# Altium project KoneXH743v1.PrjPcb
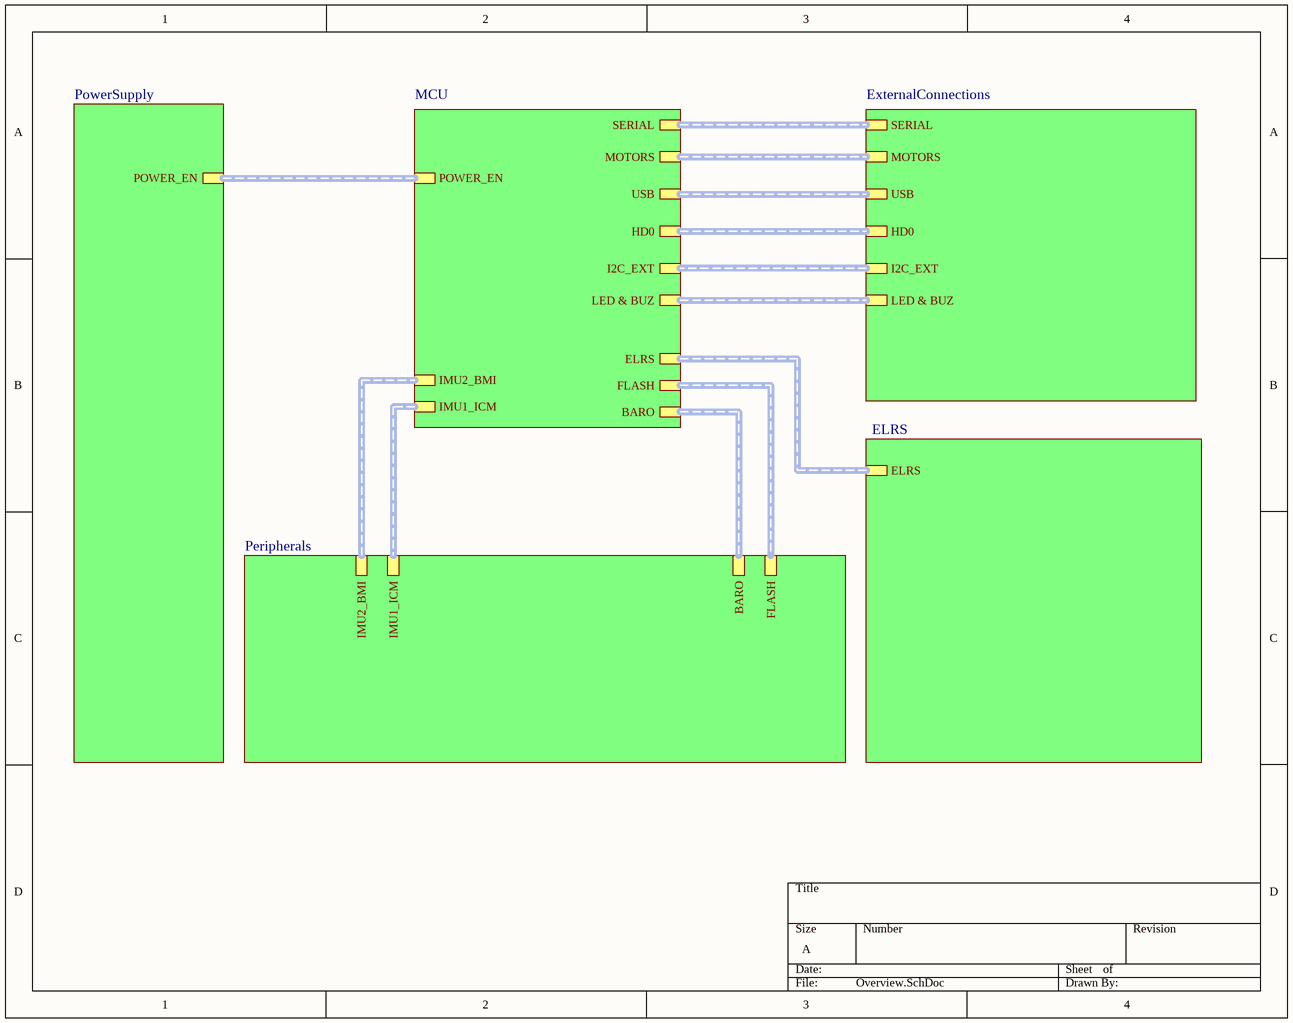
[diagram p0: Overview.SchDoc]
6 sheets, 172 parts. Net scope: hierarchical (ports join the sheet entries above them; power ports are global).
Board file: PCB_KoneXH743v1.PcbDoc
Sheets:
  Overview.SchDoc
    M1 = MCU.SchDoc
    P1 = Peripherals.SchDoc
    Pw = PowerSupply.SchDoc
    Ex = ExternalConnections.SchDoc
    RC = ELRS.SchDoc

## Sheet Overview.SchDoc
size A; SheetNumber: 1; SheetTotal: 6

### Sub-sheets
Ex = ExternalConnections: MOTORS, USB, HD0, I2C_EXT, LED & BUZ, SERIAL
M1 = MCU: IMU2_BMI, IMU1_ICM, BARO, FLASH, MOTORS, ELRS, USB, HD0, I2C_EXT, LED & BUZ, SERIAL, POWER_EN
P1 = Peripherals: IMU2_BMI, IMU1_ICM, BARO, FLASH
Pw = PowerSupply: POWER_EN
RC = ELRS: ELRS

### Buses and harness runs
harness sheet Ex/HD0 = sheet M1/HD0
harness sheet Ex/I2C_EXT = sheet M1/I2C_EXT
harness sheet Ex/LED & BUZ = sheet M1/LED & BUZ
harness sheet Ex/MOTORS = sheet M1/MOTORS
harness sheet Ex/SERIAL = sheet M1/SERIAL
harness sheet Ex/USB = sheet M1/USB
harness sheet M1/BARO = sheet P1/BARO
harness sheet M1/ELRS = sheet RC/ELRS
harness sheet M1/FLASH = sheet P1/FLASH
harness sheet M1/IMU1_ICM = sheet P1/IMU1_ICM
harness sheet M1/IMU2_BMI = sheet P1/IMU2_BMI
harness sheet M1/POWER_EN = sheet Pw/POWER_EN

## Sheet MCU.SchDoc
size A3; SheetNumber: 2; SheetTotal: 6
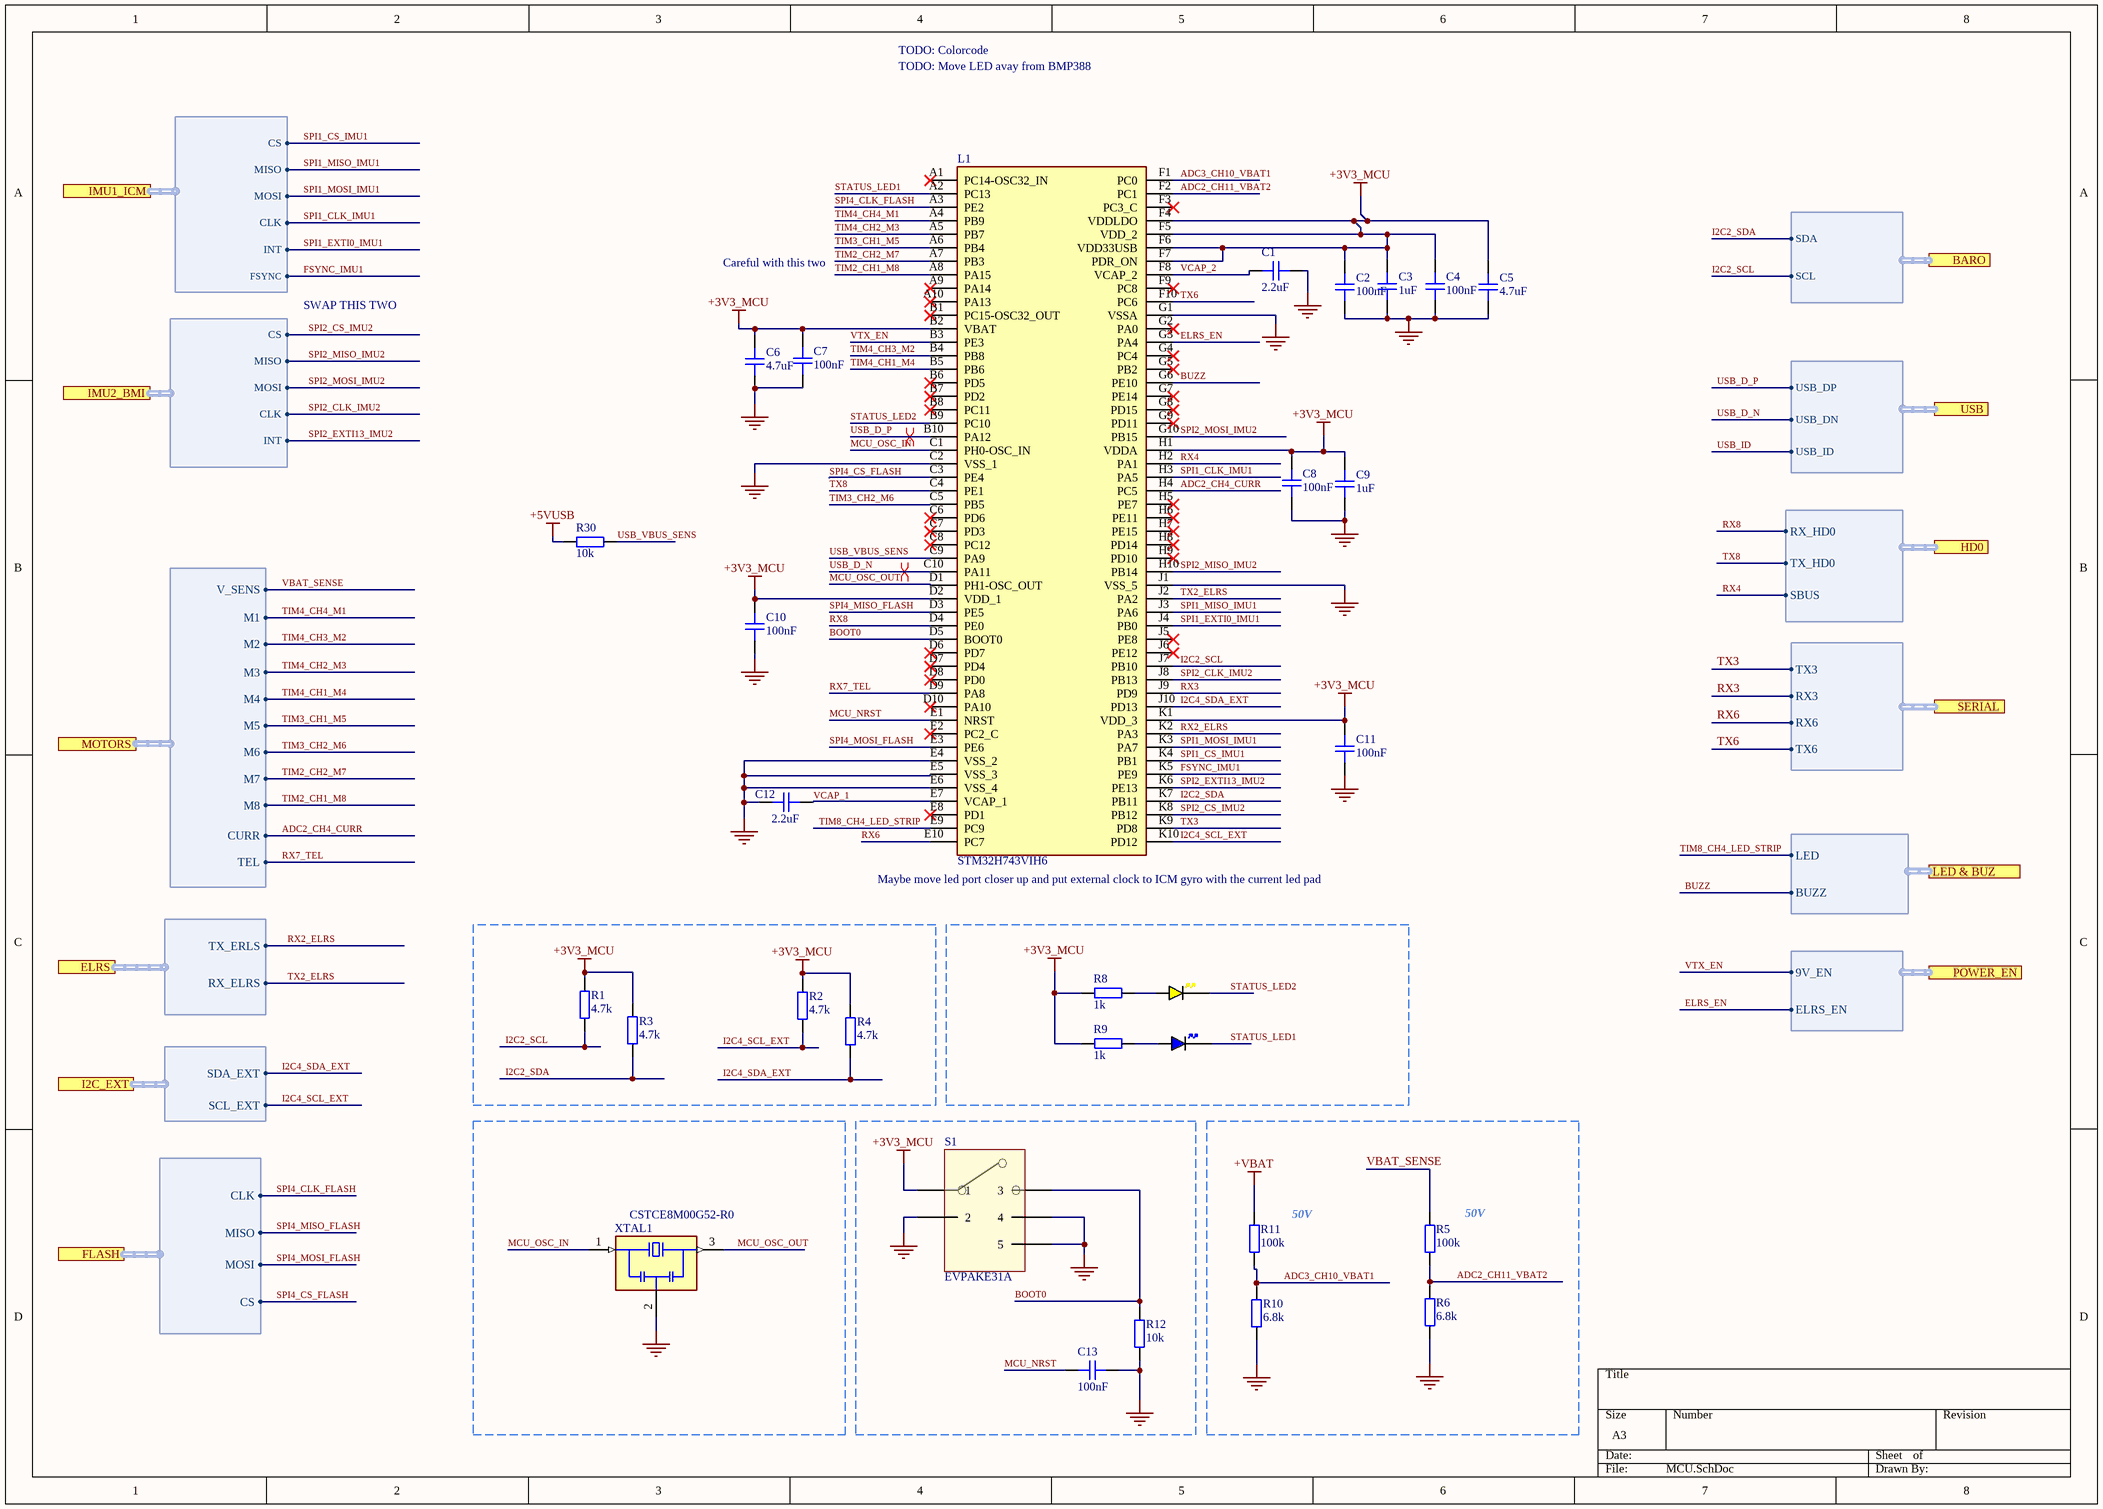
[diagram p1: MCU.SchDoc]

### Parts
C1  2.2uF  [CAP_0402]
C2  100nF  [CAP_0201]
C3  1uF  [CAP_0402]
C4  100nF  [CAP_0201]
C5  4.7uF  [CAP_0402]
C6  4.7uF  [CAP_0402]
C7  100nF  [CAP_0201]
C8  100nF  [CAP_0201]
C9  1uF  [CAP_0402]
C10  100nF  [CAP_0201]
C11  100nF  [CAP_0201]
C12  2.2uF  [CAP_0402]
C13  100nF  [CAP_0201]
L1  STM32H743VIH6  [BGA100C80P10X10_800X800X110]
LED1  YELLOW  [LED_0402_YELLOW]  (value not drawn)
LED2  BLUE  [LED_0402_BLUE]  (value not drawn)
R1  4.7k  [RES_0201]
R2  4.7k  [RES_0201]
R3  4.7k  [RES_0201]
R4  4.7k  [RES_0201]
R5  100k  [RES_0402]
R6  6.8k  [RES_0201]
R8  1k  [RES_0201]
R9  1k  [RES_0201]
R10  6.8k  [RES_0201]
R11  100k  [RES_0402]
R12  10k  [RES_0201]
R30  10k  [RES_0201]
S1  EVPAKE31A  [EVPAKE31A]
XTAL1  CSTCE8M00G52-R0  [OSC_CSTCE8M00G52-R0]

### Ports
BARO (harness I2C3_BARO, see Overview[3B], Peripherals[3A]), ELRS (harness ELRS, see Overview[3B], ELRS[2B]), FLASH (harness FLASH, see Overview[3B], Peripherals[3C]), HD0 (harness HD0, see Overview[3A], ExternalConnections[3C]), I2C_EXT (harness I2C_EXT, see Overview[3B], ExternalConnections[5C]), IMU1_ICM (harness IMU1, see Overview[2B], Peripherals[1A]), IMU2_BMI (harness IMU, see Overview[2B], Peripherals[1C]), LED & BUZ (harness MISC, see Overview[3B], ExternalConnections[5A]), MOTORS (harness MOTORS, see Overview[3A], ExternalConnections[1A]), POWER_EN (harness VTX_EN, see Overview[2A], PowerSupply[1B]), SERIAL (harness SERIAL, see Overview[3A], ExternalConnections[2C]), USB (harness USB, see Overview[3A], ExternalConnections[1C])

### Harnesses
SERIAL: TX3, RX3, RX6, TX6
I2C3_BARO: SDA, SCL
USB: USB_DP, USB_DN, USB_ID
IMU: CS, MISO, MOSI, CLK, INT
MOTORS: M2, M3, M4, M5, M6, M1, M7, M8, CURR, TEL, V_SENS
MISC: BUZZ, LED
I2C_EXT: SDA_EXT, SCL_EXT
IMU1: CS, MISO, MOSI, CLK, INT, FSYNC
ELRS: TX_ERLS, RX_ELRS
FLASH: CLK, MISO, MOSI, CS
HD0: RX_HD0, TX_HD0, SBUS
VTX_EN: 9V_EN, ELRS_EN

### Nets
+3V3_MCU: C2.2 C3.2 C4.2 C5.2 C6.2 C7.2 C8.2 C9.2 C10.2 C11.2 L1.B2(VBAT) L1.D2(VDD_1) L1.F4(VDDLDO) L1.F5(VDD_2) L1.F6(VDD33USB) L1.F7(PDR_ON) L1.H1(VDDA) L1.K1(VDD_3) R1.2 R2.2 R3.2 R4.2 R8.1 R9.1 S1.1
+5VUSB: R30.1
+VBAT: R11.2
GND: C1.2 C2.1 C3.1 C4.1 C5.1 C6.1 C7.1 C8.1 C9.1 C10.1 C11.1 C12.1 C13.2 L1.C2(VSS_1) L1.E4(VSS_2) L1.E5(VSS_3) L1.E6(VSS_4) L1.G1(VSSA) L1.J1(VSS_5) R6.1 R10.1 R12.1 S1.2 S1.4 S1.5 XTAL1.2(GND)
ADC2_CH4_CURR: L1.H4(PC5) ; port MOTORS.CURR
ADC2_CH11_VBAT2: L1.F2(PC1) R5.1 R6.2
ADC3_CH10_VBAT1: L1.F1(PC0) R10.2 R11.1
BOOT0: L1.D5(BOOT0) R12.2 S1.3
BUZZ: L1.G6(PE10) ; port LED & BUZ.BUZZ
ELRS_EN: L1.G3(PA4) ; port POWER_EN.ELRS_EN
FSYNC_IMU1: L1.K5(PE9) ; port IMU1_ICM.FSYNC
I2C2_SCL: L1.J7(PB10) R1.1 ; port BARO.SCL
I2C2_SDA: L1.K7(PB11) R3.1 ; port BARO.SDA
I2C4_SCL_EXT: L1.K10(PD12) R2.1 ; port I2C_EXT.SCL_EXT
I2C4_SDA_EXT: L1.J10(PD13) R4.1 ; port I2C_EXT.SDA_EXT
MCU_NRST: C13.1 L1.E1(NRST)
MCU_OSC_IN: L1.C1(PH0-OSC_IN) XTAL1.1(IN)
MCU_OSC_OUT: L1.D1(PH1-OSC_OUT) XTAL1.3(OUT)
RX2_ELRS: L1.K2(PA3) ; port ELRS.TX_ERLS  [project net ELRS_TX]
RX3: L1.J9(PD9) ; port SERIAL.RX3
RX4: L1.H2(PA1) ; port HD0.SBUS
RX6: L1.E10(PC7) ; port SERIAL.RX6
RX7_TEL: L1.D9(PA8) ; port MOTORS.TEL
RX8: L1.D4(PE0) ; port HD0.RX_HD0
SPI1_CLK_IMU1: L1.H3(PA5) ; port IMU1_ICM.CLK
SPI1_CS_IMU1: L1.K4(PB1) ; port IMU1_ICM.CS
SPI1_EXTI0_IMU1: L1.J4(PB0) ; port IMU1_ICM.INT
SPI1_MISO_IMU1: L1.J3(PA6) ; port IMU1_ICM.MISO
SPI1_MOSI_IMU1: L1.K3(PA7) ; port IMU1_ICM.MOSI
SPI2_CLK_IMU2: L1.J8(PB13) ; port IMU2_BMI.CLK
SPI2_CS_IMU2: L1.K8(PB12) ; port IMU2_BMI.CS
SPI2_EXTI13_IMU2: L1.K6(PE13) ; port IMU2_BMI.INT
SPI2_MISO_IMU2: L1.H10(PB14) ; port IMU2_BMI.MISO
SPI2_MOSI_IMU2: L1.G10(PB15) ; port IMU2_BMI.MOSI
SPI4_CLK_FLASH: L1.A3(PE2) ; port FLASH.CLK  [project net CLK_FLASH]
SPI4_CS_FLASH: L1.C3(PE4) ; port FLASH.CS  [project net CS_FLASH]
SPI4_MISO_FLASH: L1.D3(PE5) ; port FLASH.MISO  [project net MISO_FLASH]
SPI4_MOSI_FLASH: L1.E3(PE6) ; port FLASH.MOSI  [project net MOSI_FLASH]
STATUS_LED1: L1.A2(PC13) LED2.K
STATUS_LED2: L1.B9(PC10) LED1.K
TIM2_CH1_M8: L1.A8(PA15) ; port MOTORS.M8  [project net M8]
TIM2_CH2_M7: L1.A7(PB3) ; port MOTORS.M7  [project net M7]
TIM3_CH1_M5: L1.A6(PB4) ; port MOTORS.M5  [project net M5]
TIM3_CH2_M6: L1.C5(PB5) ; port MOTORS.M6  [project net M6]
TIM4_CH1_M4: L1.B5(PB6) ; port MOTORS.M4  [project net M4]
TIM4_CH2_M3: L1.A5(PB7) ; port MOTORS.M3  [project net M3]
TIM4_CH3_M2: L1.B4(PB8) ; port MOTORS.M2  [project net M2]
TIM4_CH4_M1: L1.A4(PB9) ; port MOTORS.M1  [project net M1]
TIM8_CH4_LED_STRIP: L1.E9(PC9) ; port LED & BUZ.LED  [project net LED_STRIP]
TX2_ELRS: L1.J2(PA2) ; port ELRS.RX_ELRS  [project net ELRS_RX]
TX3: L1.K9(PD8) ; port SERIAL.TX3
TX6: L1.F10(PC6) ; port SERIAL.TX6
TX8: L1.C4(PE1) ; port HD0.TX_HD0
USB_D_N: L1.C10(PA11) ; port USB.USB_DN
USB_D_P: L1.B10(PA12) ; port USB.USB_DP
USB_ID: port USB.USB_ID
USB_VBUS_SENS: L1.C9(PA9) R30.2
VBAT_SENSE: R5.2 ; port MOTORS.V_SENS  [project net VBAT_SENS]
VCAP_1: C12.2 L1.E7(VCAP_1)
VCAP_2: C1.1 L1.F8(VCAP_2)
VTX_EN: L1.B3(PE3) ; port POWER_EN.9V_EN  [project net 9V_EN]
NetLED1_A: LED1.A R8.2
NetLED2_A: LED2.A R9.2

Not connected (* = marked no-connect by the designer): L1 A1(PC14-OSC32_IN)* A9(PA14)* A10(PA13)* B1(PC15-OSC32_OUT)* B6(PD5)* B7(PD2)* B8(PC11)* C6(PD6)* C7(PD3)* C8(PC12)* D6(PD7)* D7(PD4)* D8(PD0)* D10(PA10)* E2(PC2_C)* E8(PD1)* F3(PC3_C)* F9(PC8)* G2(PA0)* G4(PC4)* G5(PB2)* G7(PE14)* G8(PD15)* G9(PD11)* H5(PE7)* H6(PE11)* H7(PE15)* H8(PD14)* H9(PD10)* J5(PE8)* J6(PE12)*

### Layout directives
differential pair: USB_D_N, USB_D_P

### Notes on the sheet
- TODO: Colorcode
- TODO: Move LED avay from BMP388
- SWAP THIS TWO
- Careful with this two
- (near L1) Maybe move led port closer up and put external clock to ICM gyro with the current led pad
- (near R11) 50V
- (near R5) 50V

### Library data of the parts
C1 C3 C5 C6 C9 C12 = CAP_0402: Capacitor SMD 0402; Manufacturer: *; Manufacturer Part Number: *; Distributor Link: *; LCSC: *; Rating: *; Dielectric: *
C2 C4 C7 C8 C10 C11 C13 = CAP_0201: Capacitor SMD 0201; Manufacturer: *; Manufacturer Part Number: *; Distributor Link: *; LCSC: *; Rating: *; Dielectric: *
L1 = STM32H743VIH6: Inductor; Manufacturer_Name: STMicroelectronics; Datasheet Link: https://www.st.com/resource/en/datasheet/stm32h743vi.pdf; Height: 1.1mm; Manufacturer_Part_Number: STM32H743VIH6; Mouser Part Number: 511-STM32H743VIH6; Mouser Price/Stock: https://www.mouser.co.uk/ProductDetail/STMicroelectronics/STM32H743VIH6?qs=EU6FO9ffTwep%252BmI4YnA3%2Fw%3D%3D; Arrow Part Number: STM32H743VIH6; Arrow Price/Stock: https://www.arrow.com/en/products/stm32h743vih6/stmicroelectronics?region=nac
LED1 = LED_0402_YELLOW: LED 0402 YELLOW SMD
LED2 = LED_0402_BLUE: LED 0402 BLUE SMD
R1-R4 R6 R8-R10 R12 R30 = RES_0201: Resistor SMD 0201; Manufacturer: *; Manufacturer Part Number: *; Distributor Link: *; LCSC: *
R5 R11 = RES_0402: Resistor SMD 0402; Manufacturer: *; Manufacturer Part Number: *; Distributor Link: *; LCSC: *
XTAL1 = CSTCE8M00G52-R0: 8MHz Ceramic Resonator Built in Capacitor 10pF Â±0.2% -20Â°C ~ 80Â°C Surface Mount; MF: Murata; Price: None; Check_prices: https://www.snapeda.com/parts/CSTCE8M00G52-R0/Murata%20Electronics%20North%20America/view-part/234504/?ref=eda; SnapEDA_Link: https://www.snapeda.com/parts/CSTCE8M00G52-R0/Murata%20Electronics%20North%20America/view-part/234504/?ref=snap; Package: Surface Mount Murata Electronics North America; Availability: Bad; MP: CSTCE8M00G52-R0; Value: *

## Sheet Peripherals.SchDoc
size B; SheetNumber: 4; SheetTotal: 6
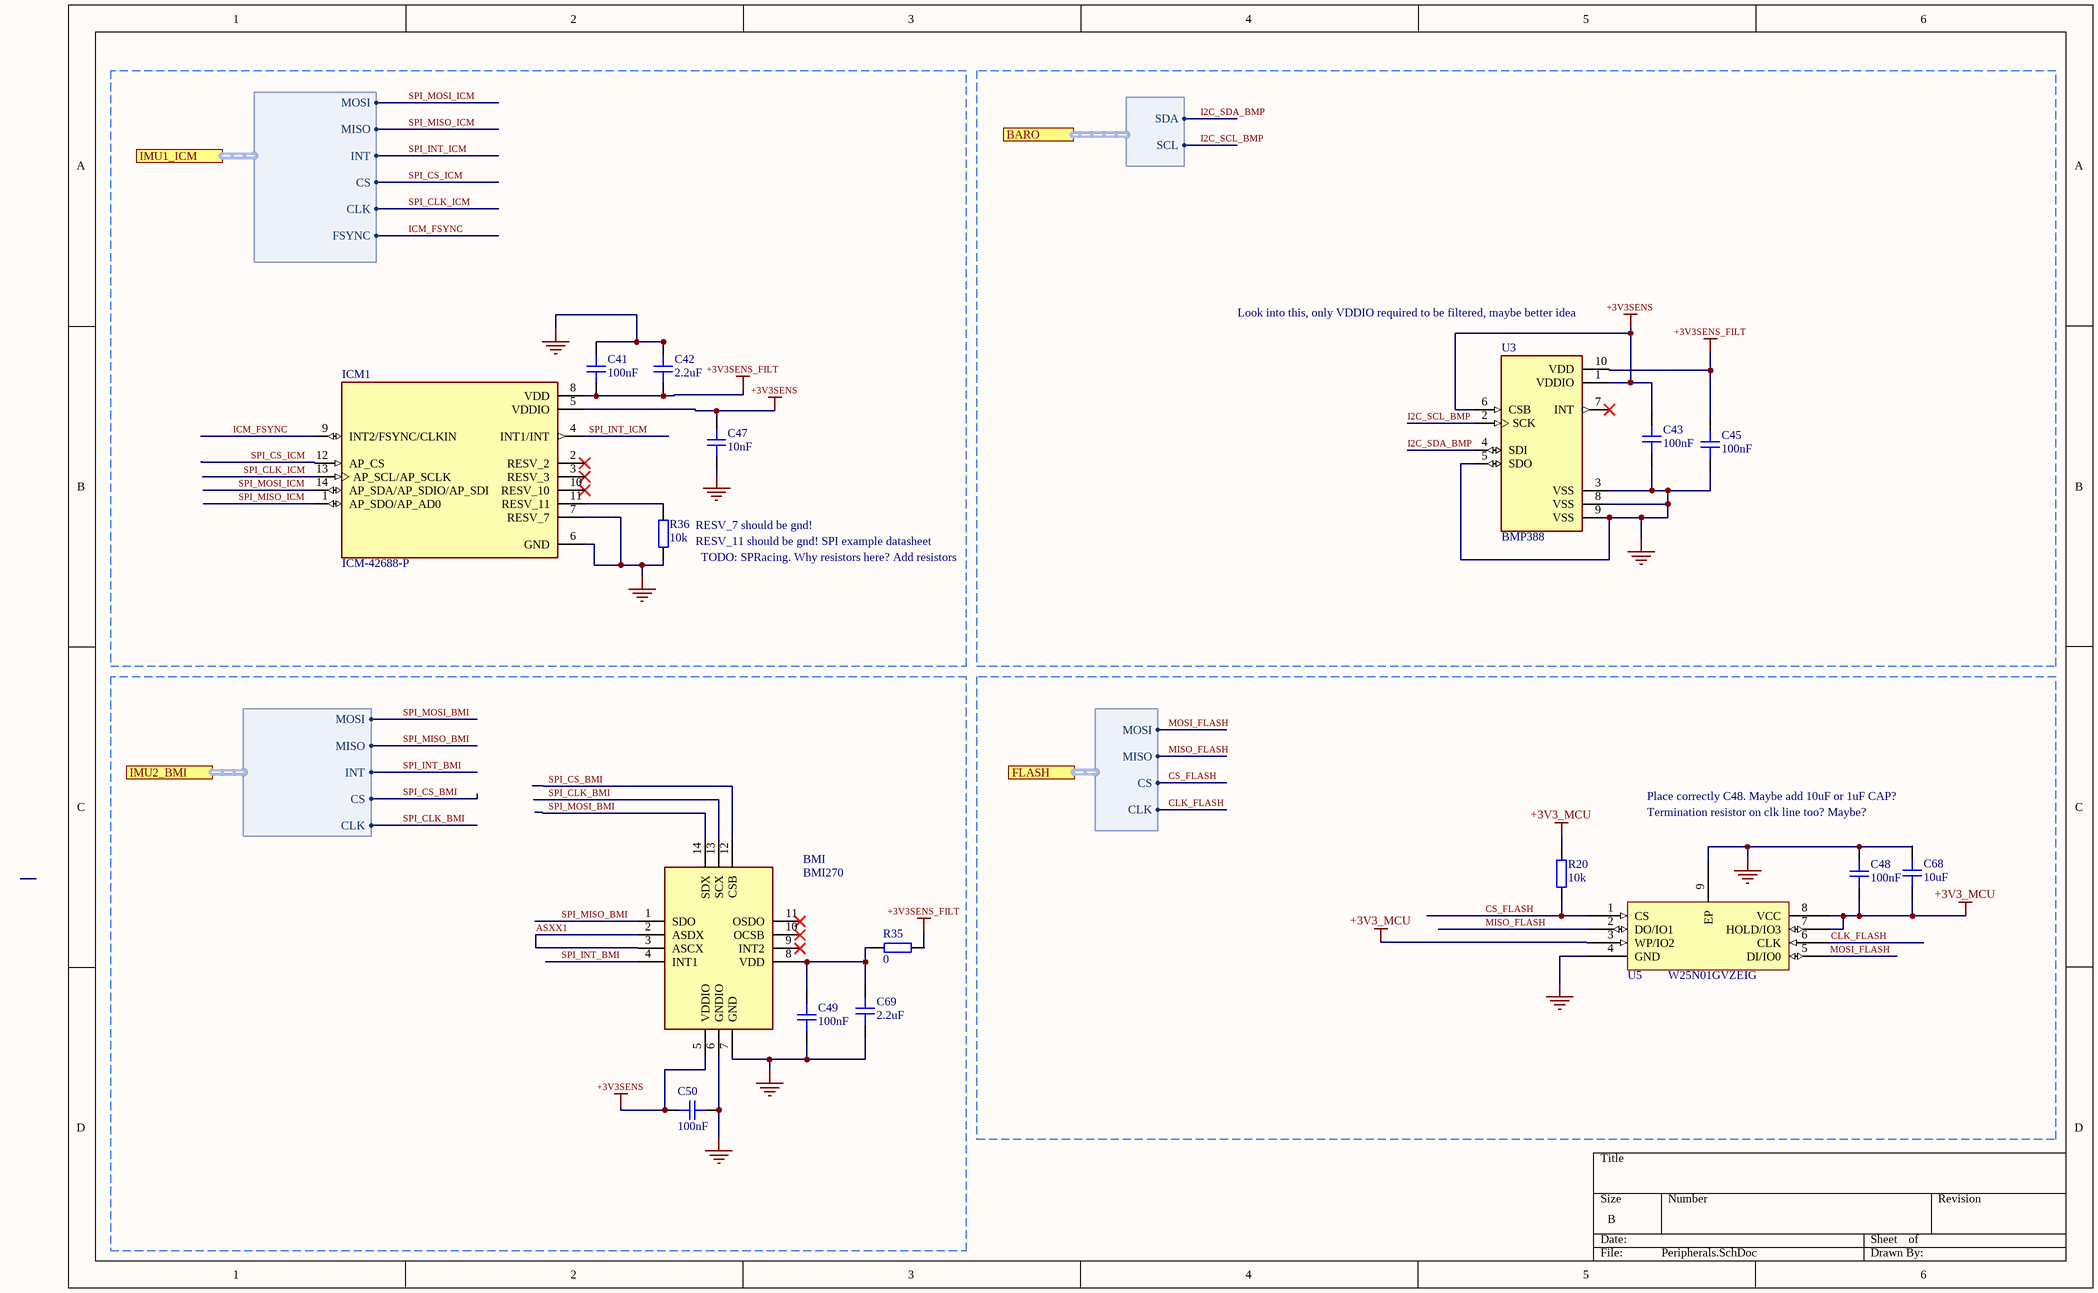
[diagram p2: Peripherals.SchDoc]

### Parts
BMI  BMI270  [BMI270]
C41  100nF  [CAP_0201]
C42  2.2uF  [CAP_0402]
C43  100nF  [CAP_0201]
C45  100nF  [CAP_0201]
C47  10nF  [CAP_0201]
C48  100nF  [CAP_0201]
C49  100nF  [CAP_0201]
C50  100nF  [CAP_0201]
C68  10uF  [CAP_0402]
C69  2.2uF  [CAP_0402]
ICM1  ICM-42688-P  [ICM-42688-P]
R20  10k  [RES_0201]
R35  0  [RES_0402]
R36  10k  [RES_0201]
U3  BMP388  [PQFN50P200X200X80-10N]
U5  W25N01GVZEIG  [W25N01GVZEIG]

### Ports
BARO (harness I2C3_BARO, see Overview[3C], MCU[8A]), FLASH (harness FLASH, see Overview[3C], MCU[1D]), IMU1_ICM (harness IMU1, see Overview[2C], MCU[1A]), IMU2_BMI (harness IMU, see Overview[2C], MCU[1B])

### Harnesses
IMU: CLK, CS, INT, MISO, MOSI
IMU1: CLK, CS, INT, MISO, MOSI, FSYNC
I2C3_BARO: SCL, SDA
FLASH: CLK, CS, MISO, MOSI

### Nets
+3V3_MCU: C48.1 C68.1 R20.2 U5.3(WP/IO2) U5.7(HOLD/IO3) U5.8(VCC)
+3V3SENS: BMI.5(VDDIO) C43.2 C47.2 C50.2 ICM1.5(VDDIO) U3.1(VDDIO) U3.6(CSB)
+3V3SENS_FILT: C41.1 C42.1 C45.2 ICM1.8(VDD) R35.2 U3.10(VDD)
GND: BMI.6(GNDIO) BMI.7(GND) C41.2 C42.2 C43.1 C45.1 C47.1 C48.2 C49.1 C50.1 C68.2 C69.1 ICM1.6(GND) ICM1.7(RESV_7) R36.1 U3.3(VSS) U3.5(SDO) U3.8(VSS) U3.9(VSS) U5.4(GND) U5.9(EP)
ASXX1: BMI.2(ASDX) BMI.3(ASCX)
CLK_FLASH: U5.6(CLK) ; port FLASH.CLK
CS_FLASH: R20.1 U5.1(CS) ; port FLASH.CS
I2C_SCL_BMP: U3.2(SCK) ; port BARO.SCL  [project net I2C2_SCL]
I2C_SDA_BMP: U3.4(SDI) ; port BARO.SDA  [project net I2C2_SDA]
ICM_FSYNC: ICM1.9(INT2/FSYNC/CLKIN) ; port IMU1_ICM.FSYNC  [project net FSYNC_IMU1]
MISO_FLASH: U5.2(DO/IO1) ; port FLASH.MISO
MOSI_FLASH: U5.5(DI/IO0) ; port FLASH.MOSI
SPI_CLK_BMI: BMI.13(SCX) ; port IMU2_BMI.CLK  [project net SPI2_CLK_IMU2]
SPI_CLK_ICM: ICM1.13(AP_SCL/AP_SCLK) ; port IMU1_ICM.CLK  [project net SPI1_CLK_IMU1]
SPI_CS_BMI: BMI.12(CSB) ; port IMU2_BMI.CS  [project net SPI2_CS_IMU2]
SPI_CS_ICM: ICM1.12(AP_CS) ; port IMU1_ICM.CS  [project net SPI1_CS_IMU1]
SPI_INT_BMI: BMI.4(INT1) ; port IMU2_BMI.INT  [project net SPI2_EXTI13_IMU2]
SPI_INT_ICM: ICM1.4(INT1/INT) ; port IMU1_ICM.INT  [project net SPI1_EXTI0_IMU1]
SPI_MISO_BMI: BMI.1(SDO) ; port IMU2_BMI.MISO  [project net SPI2_MISO_IMU2]
SPI_MISO_ICM: ICM1.1(AP_SDO/AP_AD0) ; port IMU1_ICM.MISO  [project net SPI1_MISO_IMU1]
SPI_MOSI_BMI: BMI.14(SDX) ; port IMU2_BMI.MOSI  [project net SPI2_MOSI_IMU2]
SPI_MOSI_ICM: ICM1.14(AP_SDA/AP_SDIO/AP_SDI) ; port IMU1_ICM.MOSI  [project net SPI1_MOSI_IMU1]
NetBMI_8: BMI.8(VDD) C49.2 C69.2 R35.1
NetICM1_11: ICM1.11(RESV_11) R36.2

Not connected (* = marked no-connect by the designer): BMI 9(INT2)* 10(OCSB)* 11(OSDO)*; ICM1 2(RESV_2)* 3(RESV_3)* 10(RESV_10)*; U3 7(INT)*

### Notes on the sheet
- (near U3) Look into this, only VDDIO required to be filtered, maybe better idea
- (near R36) RESV_7 should be gnd!
- (near R36) RESV_11 should be gnd! SPI example datasheet
- (near R36) TODO: SPRacing. Why resistors here? Add resistors
- Termination resistor on clk line too? Maybe?
- Place correctly C48. Maybe add 10uF or 1uF CAP?

### Library data of the parts
BMI = BMI270: Integrated Circuit; Manufacturer_Name: BOSCH; Datasheet Link: https://www.mouser.de/datasheet/2/783/BST-BMI270-FL000-1530947.pdf; Height: 0.87mm; Manufacturer_Part_Number: BMI270; Mouser Part Number: 262-BMI270; Mouser Price/Stock: https://www.mouser.co.uk/ProductDetail/Bosch-Sensortec/BMI270?qs=u16ybLDytRYIj%252BjQEee88A%3D%3D; Arrow Part Number: BMI270; Arrow Price/Stock: https://www.arrow.com/en/products/bmi270/bosch?region=nac
C41 C43 C45 C47-C50 = CAP_0201: Capacitor SMD 0201; Manufacturer: *; Manufacturer Part Number: *; Distributor Link: *; LCSC: *; Rating: *; Dielectric: *
C42 C68 C69 = CAP_0402: Capacitor SMD 0402; Manufacturer: *; Manufacturer Part Number: *; Distributor Link: *; LCSC: *; Rating: *; Dielectric: *
R20 R36 = RES_0201: Resistor SMD 0201; Manufacturer: *; Manufacturer Part Number: *; Distributor Link: *; LCSC: *
R35 = RES_0402: Resistor SMD 0402; Manufacturer: *; Manufacturer Part Number: *; Distributor Link: *; LCSC: *
U3 = BMP388: P-Sensor SPI I2C 1, 25 Bar SMD; Package: None; Price: None; Value: *; MP: BMP388; Availability: Unavailable
U5 = W25N01GVZEIG: Manufacturer: Windbond Elec; Manufacturer part: W25N01GVZEIG; LCSC part: C88868

## Sheet PowerSupply.SchDoc
size A3; SheetNumber: 3; SheetTotal: 6
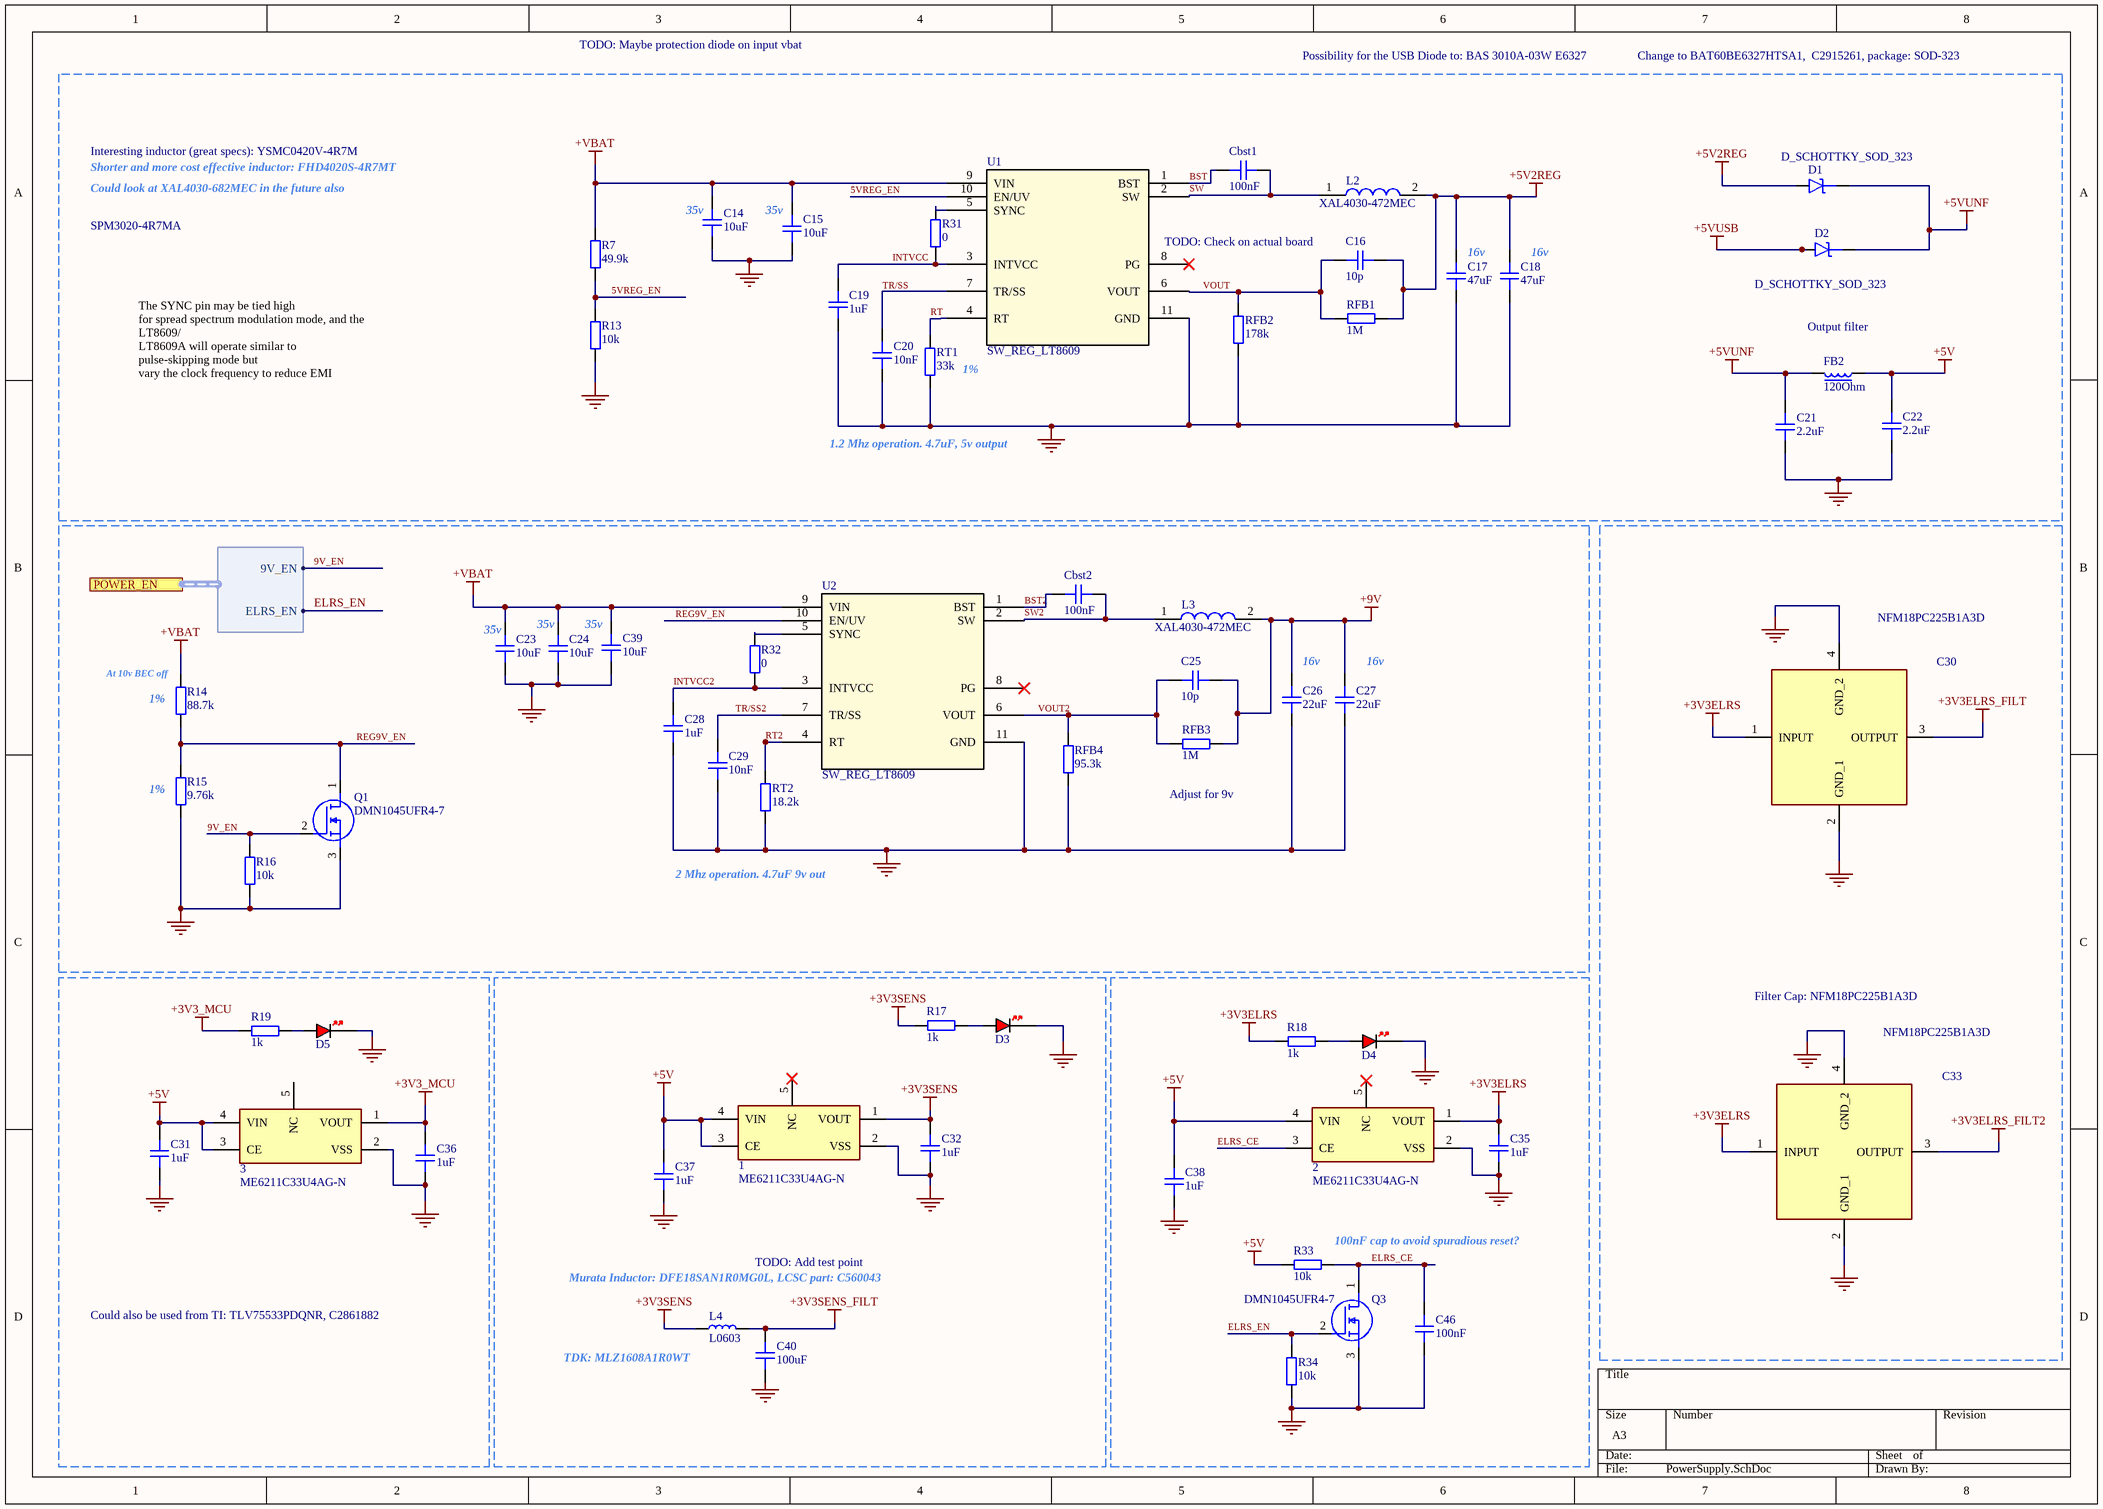
[diagram p3: PowerSupply.SchDoc]

### Parts
1  ME6211C33U4AG-N  [X2-SON-4-EP(1x1)]
2  ME6211C33U4AG-N  [X2-SON-4-EP(1x1)]
3  ME6211C33U4AG-N  [X2-SON-4-EP(1x1)]
C14  10uF  [CAP_0805]
C15  10uF  [CAP_0805]
C16  10p  [CAP_0201]
C17  47uF  [CAP_0603]
C18  47uF  [CAP_0603]
C19  1uF  [CAP_0402]
C20  10nF  [CAP_0201]
C21  2.2uF  [CAP_0402]
C22  2.2uF  [CAP_0402]
C23  10uF  [CAP_0805]
C24  10uF  [CAP_0805]
C25  10p  [CAP_0201]
C26  22uF  [CAP_0603]
C27  22uF  [CAP_0603]
C28  1uF  [CAP_0402]
C29  10nF  [CAP_0201]
C30  NFM18PC225B1A3D  [NFM18PC225B1A3D]
C31  1uF  [CAP_0402]
C32  1uF  [CAP_0402]
C33  NFM18PC225B1A3D  [NFM18PC225B1A3D]
C35  1uF  [CAP_0402]
C36  1uF  [CAP_0402]
C37  1uF  [CAP_0402]
C38  1uF  [CAP_0402]
C39  10uF  [CAP_0603]
C40  100uF  [CAP_0805]
C46  100nF  [CAP_0201]
Cbst1  100nF  [CAP_0201]
Cbst2  100nF  [CAP_0201]
D1  D_SCHOTTKY_SOD_323  [SOD-323]
D2  D_SCHOTTKY_SOD_323  [SOD-323]
D3  RED  [LED_0402_RED]  (value not drawn)
D4  RED  [LED_0402_RED]  (value not drawn)
D5  RED  [LED_0402_RED]  (value not drawn)
FB2  120Ohm  [FB_0603]
L2  XAL4030-472MEC  [IND-SMD_L4.0-W4.0]
L3  XAL4030-472MEC  [IND-SMD_L4.0-W4.0]
L4  L0603  [IND_0603]
Q1  DMN1045UFR4-7  [DMP1200UFR47]
Q3  DMN1045UFR4-7  [DMP1200UFR47]
R7  49.9k  [RES_0402]
R13  10k  [RES_0201]
R14  88.7k  [RES_0402]
R15  9.76k  [RES_0201]
R16  10k  [RES_0201]
R17  1k  [RES_0201]
R18  1k  [RES_0201]
R19  1k  [RES_0201]
R31  0  [RES_0201]
R32  0  [RES_0201]
R33  10k  [RES_0201]
R34  10k  [RES_0201]
RFB1  1M  [RES_0201]
RFB2  178k  [RES_0201]
RFB3  1M  [RES_0201]
RFB4  95.3k  [RES_0201]
RT1  33k  [RES_0201]
RT2  18.2k  [RES_0201]
U1  SW_REG_LT8609  [SW_REG_LT8609]
U2  SW_REG_LT8609  [SW_REG_LT8609]

### Blocks framed on the sheet
Filter Cap: NFM18PC225B1A3D: C30 C33
Could also be used from TI: TLV75533PDQNR, C2861882: 3 C31 C36 D5 R19
100nF cap to avoid spuradious reset?: 2 C35 C38 C46 D4 Q3 R18 R33 R34

### Ports
POWER_EN (harness VTX_EN, see Overview[1A], MCU[8C])

### Harnesses
VTX_EN: 9V_EN, ELRS_EN

### Nets
+3V3_MCU: 3.1(VOUT) C36.2 R19.1
+3V3ELRS: 2.1(VOUT) C30.1(INPUT) C33.1(INPUT) C35.2 R18.1
+3V3ELRS_FILT: C30.3(OUTPUT)
+3V3ELRS_FILT2: C33.3(OUTPUT)
+3V3SENS: 1.1(VOUT) C32.2 L4.1 R17.1
+3V3SENS_FILT: C40.2 L4.2
+5V: 1.3(CE) 1.4(VIN) 2.4(VIN) 3.3(CE) 3.4(VIN) C22.2 C31.2 C37.2 C38.2 FB2.1 R33.2
+5V2REG: C16.2 C17.1 C18.1 D1.A L2.2 RFB1.1
+5VUNF: C21.2 D1.K D2.K FB2.2
+5VUSB: D2.A
+9V: C25.2 C26.1 C27.1 L3.2 RFB3.1
+VBAT: C14.2 C15.2 C23.2 C24.2 C39.2 R7.2 R14.2 U1.9(VIN) U2.9(VIN)
GND: 1.2(VSS) 2.2(VSS) 3.2(VSS) C14.1 C15.1 C17.2 C18.2 C19.1 C20.1 C21.1 C22.1 C23.1 C24.1 C26.2 C27.2 C28.1 C29.1 C30.2(GND_1) C30.4(GND_2) C31.1 C32.1 C33.2(GND_1) C33.4(GND_2) C35.1 C36.1 C37.1 C38.1 C39.1 C40.1 C46.1 D3.K D4.K D5.K Q1.3(S) Q3.3(S) R13.1 R15.1 R16.1 R34.1 RFB2.1 RFB4.1 RT1.1 RT2.2 U1.11(GND) U2.11(GND)
5VREG_EN: R7.1 R13.2 U1.10(EN/UV)
9V_EN: Q1.2(G) R16.2 ; port POWER_EN.9V_EN
BST: Cbst1.1 U1.1(BST)
BST2: Cbst2.1 U2.1(BST)
ELRS_CE: 2.3(CE) C46.2 Q3.1(D) R33.1
ELRS_EN: Q3.2(G) R34.2 ; port POWER_EN.ELRS_EN
INTVCC: C19.2 R31.1 U1.3(INTVCC)
INTVCC2: C28.2 R32.1 U2.3(INTVCC)
REG9V_EN: Q1.1(D) R14.1 R15.2 U2.10(EN/UV)
RT: RT1.2 U1.4(RT)
RT2: RT2.1 U2.4(RT)
SW: Cbst1.2 L2.1 U1.2(SW)
SW2: Cbst2.2 L3.1 U2.2(SW)
TR/SS: C20.2 U1.7(TR/SS)
TR/SS2: C29.2 U2.7(TR/SS)
VOUT: C16.1 RFB1.2 RFB2.2 U1.6(VOUT)
VOUT2: C25.1 RFB3.2 RFB4.2 U2.6(VOUT)
NetD3_A: D3.A R17.2
NetD4_A: D4.A R18.2
NetD5_A: D5.A R19.2
NetR31_2: R31.2 U1.5(SYNC)
NetR32_2: R32.2 U2.5(SYNC)

Not connected (* = marked no-connect by the designer): 1 5(NC)*; 2 5(NC)*; 3 5(NC); U1 8(PG)*; U2 8(PG)*

### Notes on the sheet
- TODO: Maybe protection diode on input vbat
- Possibility for the USB Diode to: BAS 3010A-03W E6327
- Change to BAT60BE6327HTSA1,  C2915261, package: SOD-323
- Shorter and more cost effective inductor: FHD4020S-4R7MT
- Interesting inductor (great specs): YSMC0420V-4R7M
- Could look at XAL4030-682MEC in the future also
- SPM3020-4R7MA
- (near C14) 35v
- (near C15) 35v
- TODO: Check on actual board
- (near C17) 16v
- (near C18) 16v
- 1%
- (near FB2) Output filter
- The SYNC pin may be tied high
  for spread spectrum modulation mode, and the LT8609/
  LT8609A will operate similar to pulse-skipping mode but
  vary the clock frequency to reduce EMI
- 1.2 Mhz operation. 4.7uF, 5v output
- (near C23) 35v
- (near C24) 35v
- (near C39) 35v
- (near R14) At 10v BEC off
- (near R14) 1%
- 16v
- (near C27) 16v
- (near R15) 1%
- (near RFB3) Adjust for 9v
- 2 Mhz operation. 4.7uF 9v out
- Murata Inductor: DFE18SAN1R0MG0L, LCSC part: C560043
- TODO: Add test point
- (near L4) TDK: MLZ1608A1R0WT

### Library data of the parts
1-3 = ME6211C33U4AG-N: Integrated Circuit; Manufacturer_Name: Microne; Manufacturer_Part_Number: ME6211C33M5G-N; Datasheet Link: https://datasheet.lcsc.com/szlcsc/1811131510_MICRONE-Nanjing-Micro-One-Elec-ME6211C33M5G-N_C82942.pdf; Height: 1.45mm; LCSC Part #: C82942
C14 C15 C23 C24 C40 = CAP_0805: Capacitor SMD 0805; Manufacturer: *; Manufacturer Part Number: *; Distributor Link: *; LCSC: *; Rating: *; Dielectric: *
C16 C20 C25 C29 C46 Cbst1 Cbst2 = CAP_0201: Capacitor SMD 0201; Manufacturer: *; Manufacturer Part Number: *; Distributor Link: *; LCSC: *; Rating: *; Dielectric: *
C17 C18 C26 C27 C39 = CAP_0603: Capacitor SMD 0603; Manufacturer: *; Manufacturer Part Number: *; Distributor Link: *; LCSC: *; Rating: *; Dielectric: *
C19 C21 C22 C28 C31 C32 C35-C38 = CAP_0402: Capacitor SMD 0402; Manufacturer: *; Manufacturer Part Number: *; Distributor Link: *; LCSC: *; Rating: *; Dielectric: *
C30 C33 = NFM18PC225B1A3D: Capacitor; Manufacturer_Name: Murata Electronics; Datasheet Link: https://search.murata.co.jp/Ceramy/image/img/A01X/G101/ENG/NFM18PC225B1A3-01.pdf; Height: 0.9mm; Manufacturer_Part_Number: NFM18PC225B1A3D; Mouser Part Number: 81-NFM18PC225B1A3D; Mouser Price/Stock: https://www.mouser.co.uk/ProductDetail/Murata-Electronics/NFM18PC225B1A3D?qs=%2F%252BYoplLUB5j1f96c1CfWTw%3D%3D; Arrow Part Number: NFM18PC225B1A3D; Arrow Price/Stock: https://www.arrow.com/en/products/nfm18pc225b1a3d/murata-manufacturing?region=europe
D1 D2 = D_SCHOTTKY_SOD_323: Diode Schottky SMD SOD-323
D3-D5 = LED_0402_RED: LED 0402 RED SMD
FB2 = FB_0603: Ferrite Bead SMD 0603; Manufacturer: *; Manufacturer Part Number: *; Distributor Link: *; LCSC: *
L2 L3 = XAL4030-472MEC: Inductor; Manufacturer_Name: COILCRAFT; Datasheet Link: https://www.mouser.com/datasheet/2/597/xal4000-270751.pdf; Height: 3.1mm; Manufacturer_Part_Number: XAL4030-472MEC; Mouser Part Number: 994-XAL4030-472MEC; Mouser Price/Stock: https://www.mouser.co.uk/ProductDetail/Coilcraft/XAL4030-472MEC?qs=zCSbvcPd3pZOjkLG9RPHEg%3D%3D
L4 = IND_0603: Inductor SMD 0603
Q1 Q3 = DMN1045UFR4-7: MOSFET (N-Channel); Manufacturer_Name: Diodes Incorporated; Datasheet Link: https://www.diodes.com//assets/Datasheets/DMN1045UFR4.pdf; Manufacturer_Part_Number: DMN1045UFR4-7; Mouser Part Number: 621-DMN1045UFR4-7; Mouser Price/Stock: https://www.mouser.co.uk/ProductDetail/Diodes-Incorporated/DMN1045UFR4-7?qs=OVC8WVYZliTSRHekNl8zHg%3D%3D; Arrow Part Number: DMN1045UFR4-7; Arrow Price/Stock: https://www.arrow.com/en/products/dmn1045ufr4-7/diodes-incorporated
R7 R14 = RES_0402: Resistor SMD 0402; Manufacturer: *; Manufacturer Part Number: *; Distributor Link: *; LCSC: *
R13 R15-R19 R31-R34 RFB1-RFB4 RT1 RT2 = RES_0201: Resistor SMD 0201; Manufacturer: *; Manufacturer Part Number: *; Distributor Link: *; LCSC: *
U1 U2 = SW_REG_LT8609: Mfr.Part: LT8609AJDDM#WTRPBF; LCSC Part #: C5122347

## Sheet ExternalConnections.SchDoc
size B; SheetNumber: 5; SheetTotal: 6
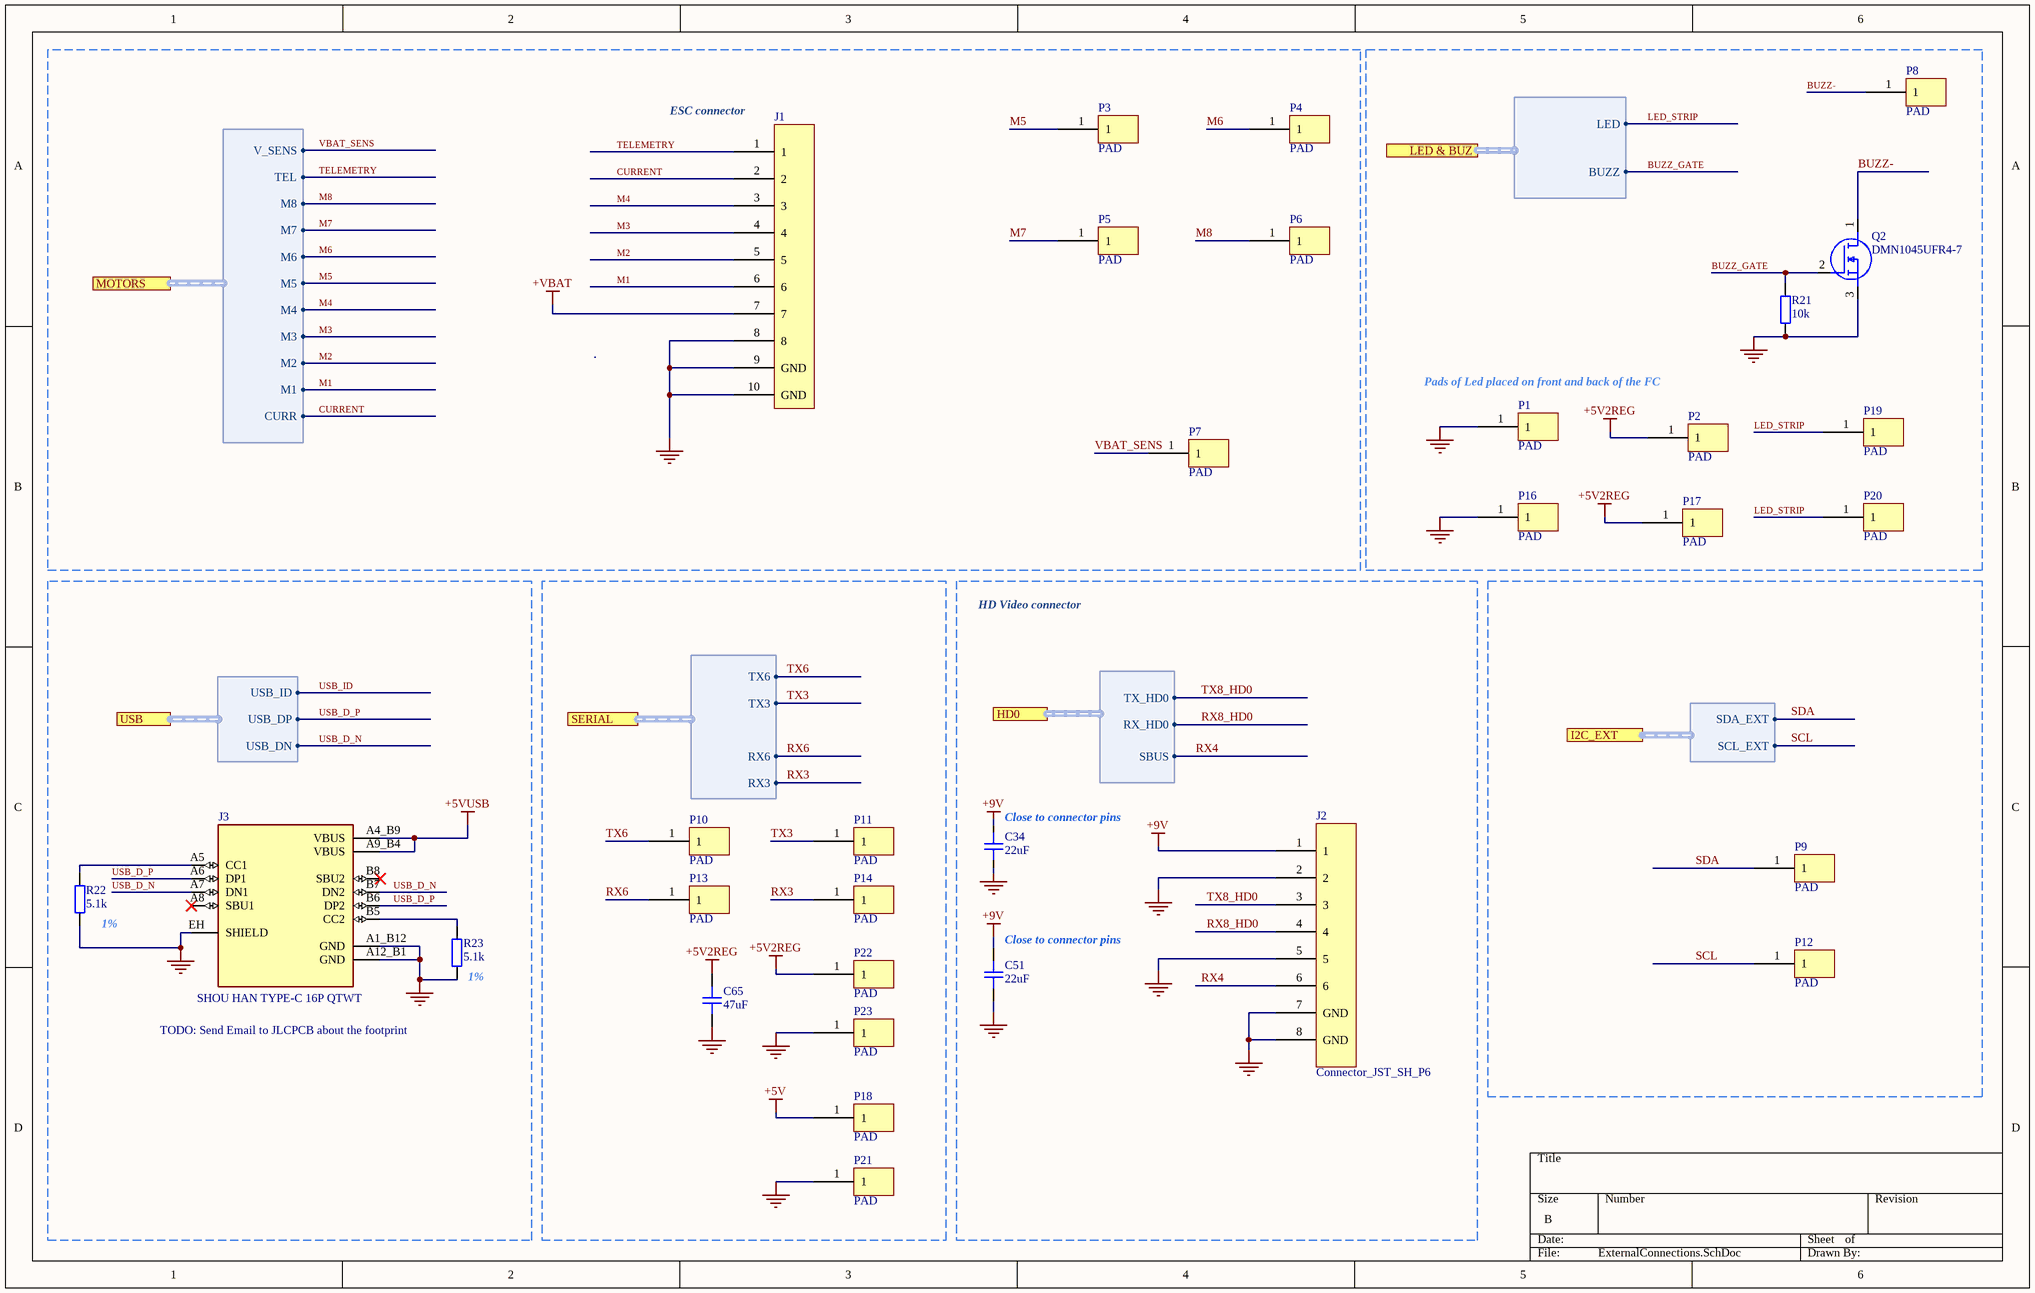
[diagram p4: ExternalConnections.SchDoc]

### Parts
C34  22uF  [CAP_0603]
C51  22uF  [CAP_0603]
C65  47uF  [CAP_0603]
J1  Connector_JST_SH_P8  [Connector_JST_SH_P8]  (value not drawn)
J2  Connector_JST_SH_P6  [Connector_JST_SH_P6]
J3  SHOU HAN TYPE-C 16P QTWT  [USBC_NoHolse]
P1  PAD  [PAD]
P2  PAD  [PAD]
P3  PAD  [PAD]
P4  PAD  [PAD]
P5  PAD  [PAD]
P6  PAD  [PAD]
P7  PAD  [PAD]
P8  PAD  [PAD]
P9  PAD  [PAD]
P10  PAD  [PAD]
P11  PAD  [PAD]
P12  PAD  [PAD]
P13  PAD  [PAD]
P14  PAD  [PAD]
P16  PAD  [PAD]
P17  PAD  [PAD]
P18  PAD  [PAD]
P19  PAD  [PAD]
P20  PAD  [PAD]
P21  PAD  [PAD]
P22  PAD  [PAD]
P23  PAD  [PAD]
Q2  DMN1045UFR4-7  [DMP1200UFR47]
R21  10k  [RES_0201]
R22  5.1k  [RES_0201]
R23  5.1k  [RES_0201]

### Blocks framed on the sheet
ESC connector: J1 P3-P7
Pads of Led placed on front and back of the FC: P1 P2 P8 P16 P17 P19 P20 Q2 R21

### Ports
HD0 (harness HD0, see Overview[3A], MCU[8B]), I2C_EXT (harness I2C_EXT, see Overview[3B], MCU[1C]), LED & BUZ (harness LED_BUZZ, see Overview[3B], MCU[8C]), MOTORS (harness MOTORS, see Overview[3A], MCU[1B]), SERIAL (harness SERIAL, see Overview[3A], MCU[8B]), USB (harness USB, see Overview[3A], MCU[8B])

### Harnesses
MOTORS: CURR, M1, M2, M3, M4, M5, M6, M7, M8, TEL, V_SENS
USB: USB_DN, USB_DP, USB_ID
I2C_EXT: SCL_EXT, SDA_EXT
SERIAL: RX3, RX6, TX3, TX6
HD0: RX_HD0, TX_HD0, SBUS
LED_BUZZ: LED, BUZZ

### Nets
+5V: P18.1
+5V2REG: C65.1 P2.1 P17.1 P22.1
+5VUSB: J3.A4_B9(VBUS) J3.A9_B4(VBUS)
+9V: C34.1 C51.1 J2.1
+VBAT: J1.7
GND: C34.2 C51.2 C65.2 J1.8 J1.9(GND) J1.10(GND) J2.2 J2.5 J2.7(GND) J2.8(GND) J3.A1_B12(GND) J3.A12_B1(GND) J3.EH(SHIELD) P1.1 P16.1 P21.1 P23.1 Q2.3(S) R21.1 R22.1 R23.1
BUZZ-: P8.1 Q2.1(D)
BUZZ_GATE: Q2.2(G) R21.2 ; port LED & BUZ.BUZZ  [project net BUZZ]
CURRENT: J1.2 ; port MOTORS.CURR  [project net ADC2_CH4_CURR]
LED_STRIP: P19.1 P20.1 ; port LED & BUZ.LED
M1: J1.6 ; port MOTORS.M1
M2: J1.5 ; port MOTORS.M2
M3: J1.4 ; port MOTORS.M3
M4: J1.3 ; port MOTORS.M4
M5: P3.1 ; port MOTORS.M5
M6: P4.1 ; port MOTORS.M6
M7: P5.1 ; port MOTORS.M7
M8: P6.1 ; port MOTORS.M8
RX3: P14.1 ; port SERIAL.RX3
RX4: J2.6 ; port HD0.SBUS
RX6: P13.1 ; port SERIAL.RX6
RX8_HD0: J2.4 ; port HD0.RX_HD0  [project net RX8]
SCL: P12.1 ; port I2C_EXT.SCL_EXT  [project net I2C4_SCL_EXT]
SDA: P9.1 ; port I2C_EXT.SDA_EXT  [project net I2C4_SDA_EXT]
TELEMETRY: J1.1 ; port MOTORS.TEL  [project net RX7_TEL]
TX3: P11.1 ; port SERIAL.TX3
TX6: P10.1 ; port SERIAL.TX6
TX8_HD0: J2.3 ; port HD0.TX_HD0  [project net TX8]
USB_D_N: J3.A7(DN1) J3.B7(DN2) ; port USB.USB_DN
USB_D_P: J3.A6(DP1) J3.B6(DP2) ; port USB.USB_DP
USB_ID: port USB.USB_ID
VBAT_SENS: P7.1 ; port MOTORS.V_SENS
NetJ3_A5: J3.A5(CC1) R22.2
NetJ3_B5: J3.B5(CC2) R23.2

Not connected (* = marked no-connect by the designer): J3 A8(SBU1)* B8(SBU2)*

### Notes on the sheet
- HD Video connector
- (near C34) Close to connector pins
- (near R22) 1%
- (near C51) Close to connector pins
- TODO: Send Email to JLCPCB about the footprint
- (near R23) 1%

### Library data of the parts
C34 C51 C65 = CAP_0603: Capacitor SMD 0603; Manufacturer: *; Manufacturer Part Number: *; Distributor Link: *; LCSC: *; Rating: *; Dielectric: *
Q2 = DMN1045UFR4-7: as Q1 on sheet PowerSupply; Datasheet Link: https://www.diodes.com//assets/Datasheets/DMN1045UFR4.pdf; Manufacturer_Part_Number: DMN1045UFR4-7; Mouser Part Number: 621-DMN1045UFR4-7; Mouser Price/Stock: https://www.mouser.co.uk/ProductDetail/Diodes-Incorporated/DMN1045UFR4-7?qs=OVC8WVYZliTSRHekNl8zHg%3D%3D; Arrow Part Number: DMN1045UFR4-7; Arrow Price/Stock: https://www.arrow.com/en/products/dmn1045ufr4-7/diodes-incorporated
R21-R23 = RES_0201: Resistor SMD 0201; Manufacturer: *; Manufacturer Part Number: *; Distributor Link: *; LCSC: *
J1 = Connector_JST_SH_P8: LCSC Part #: C3041142
J2 = Connector_JST_SH_P6: LCSC Part #: C3041141
J3 = SHOU HAN TYPE-C 16P QTWT: LCSC Part #: C5187472; Mfr. Part #: TYPE-C 16P QTWT; Datasheet: https://www.lcsc.com/datasheet/lcsc_datasheet_2209291730_SHOU-HAN-TYPE-C-16P-QTWT_C5187472.pdf; Manufacturer: SHOU HAN

## Sheet ELRS.SchDoc
size C; SheetNumber: 6; SheetTotal: 6
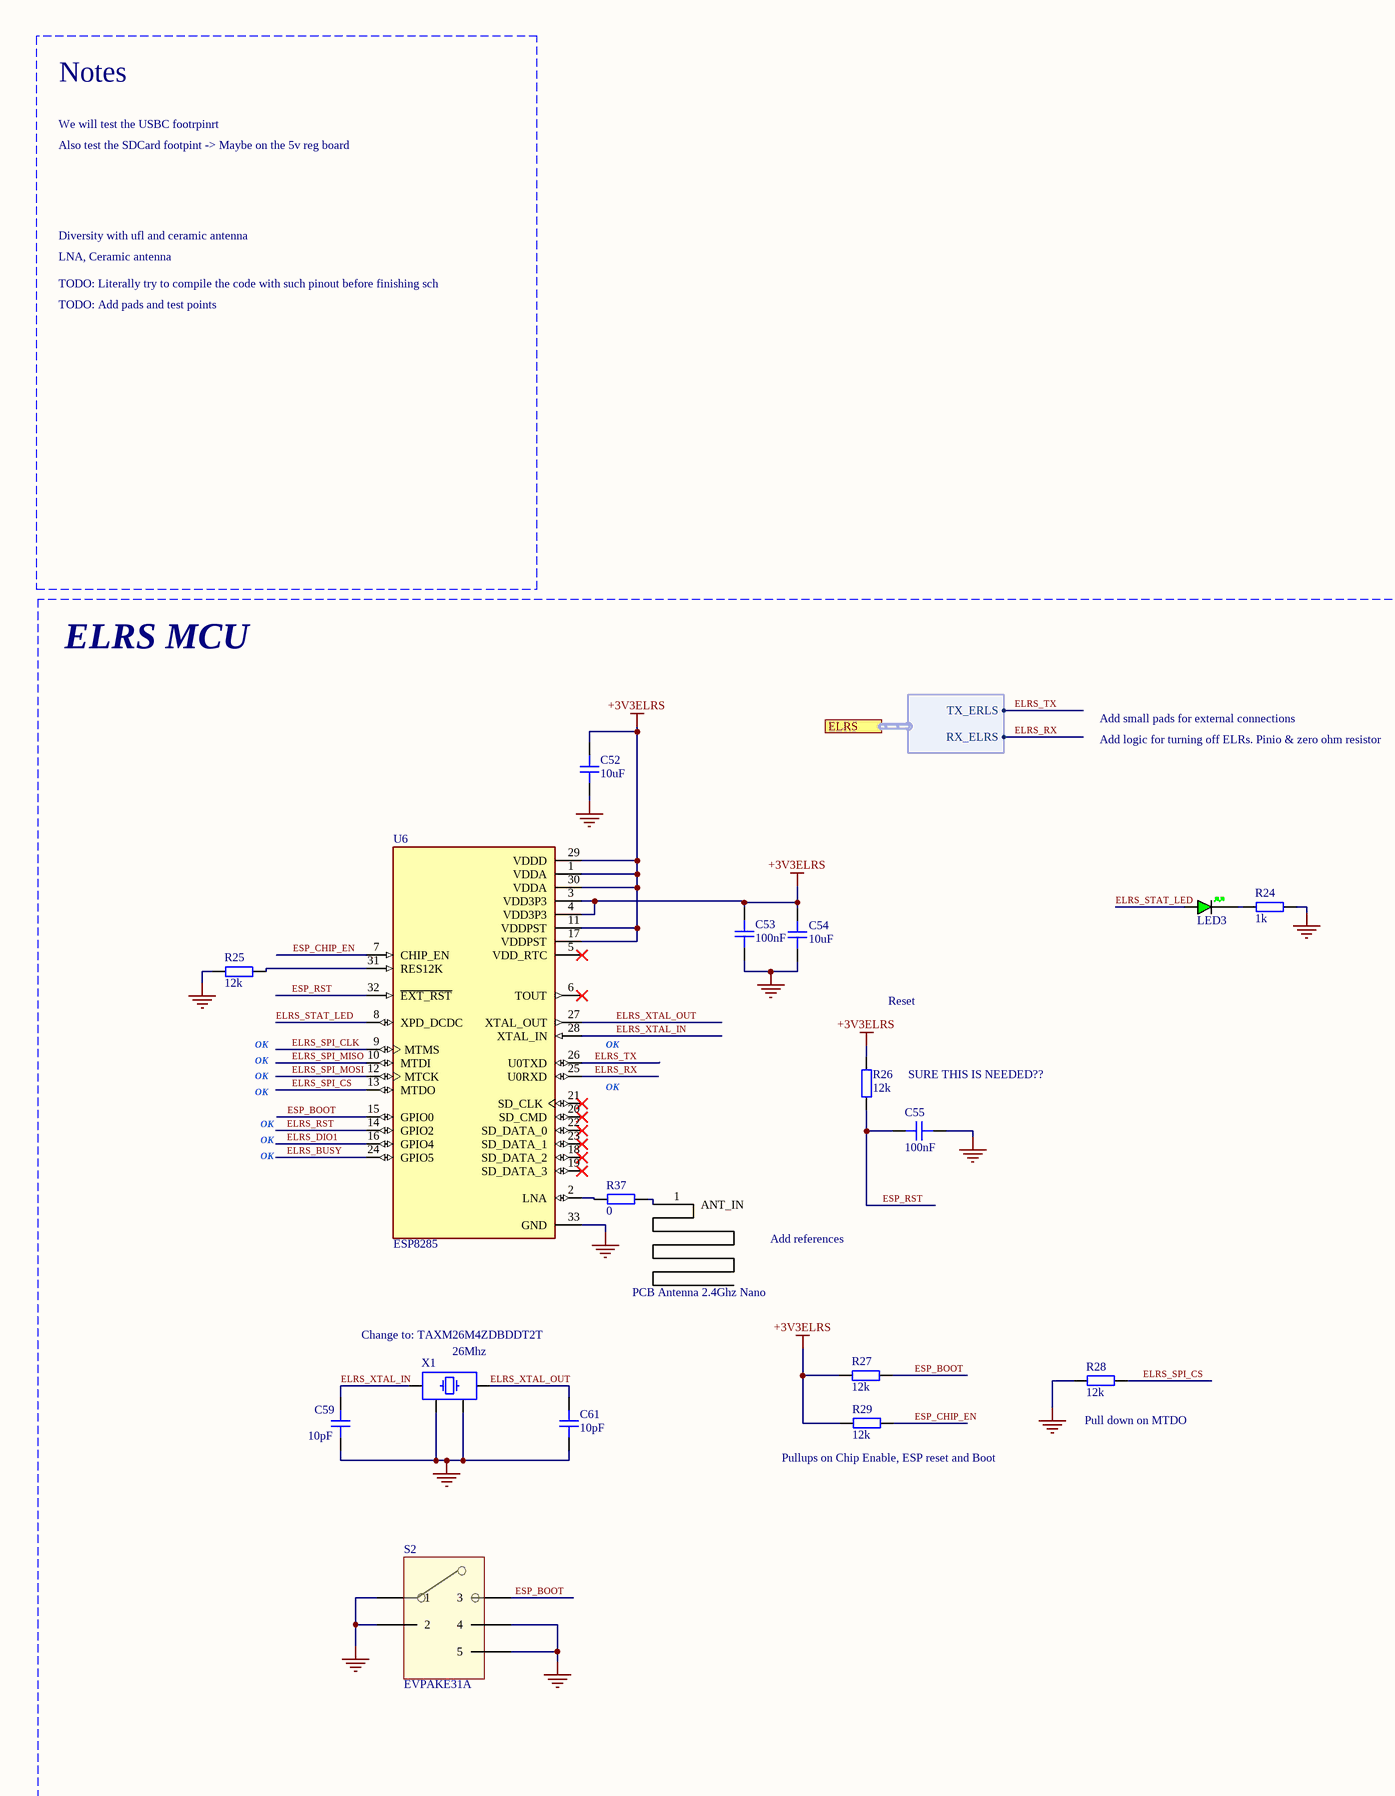
[diagram p5: ELRS.SchDoc, left]
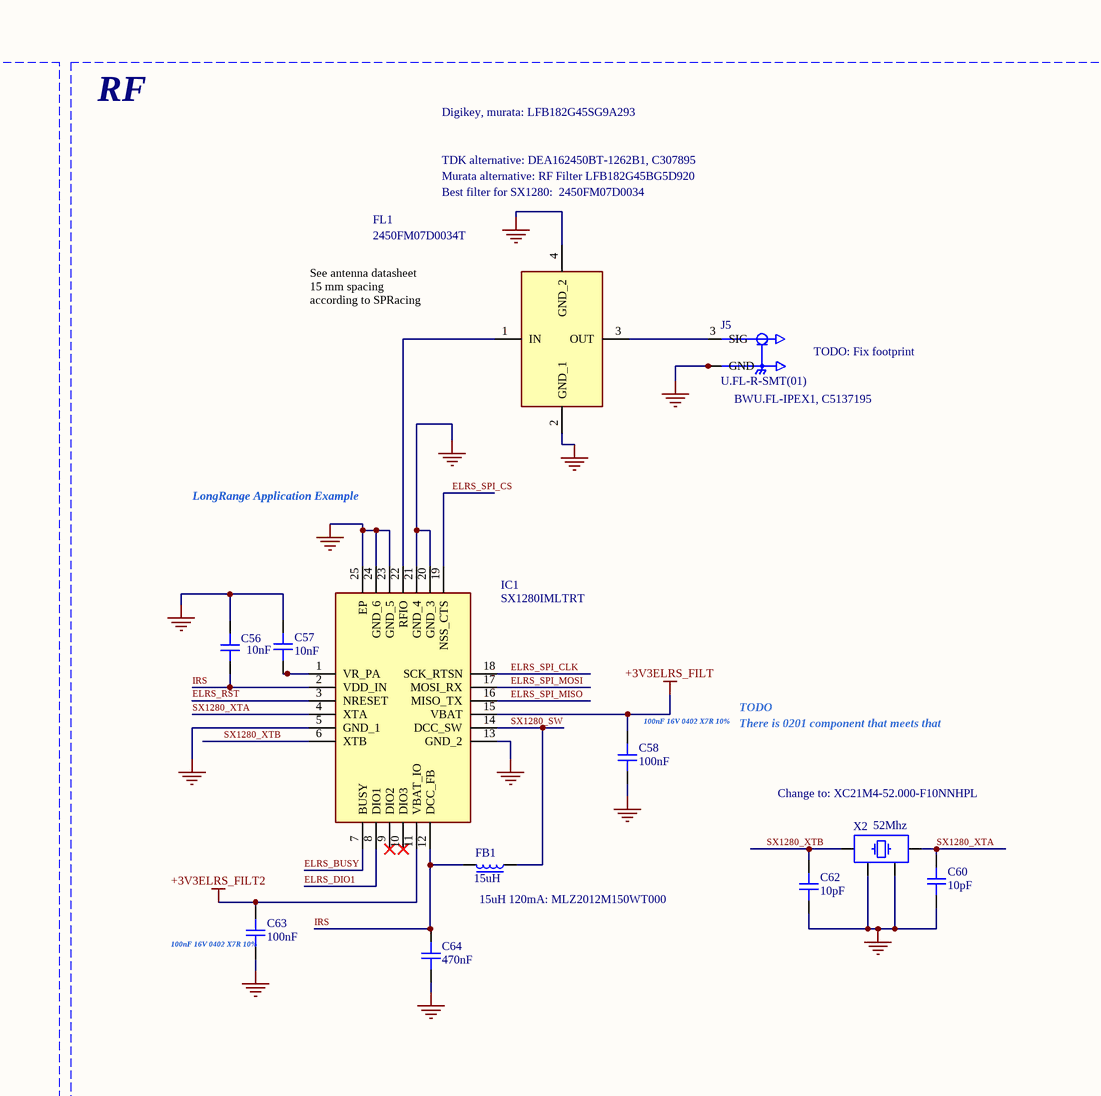
[diagram p6: ELRS.SchDoc, right]

### Parts
C52  10uF  [CAP_0402]
C53  100nF  [CAP_0201]
C54  10uF  [CAP_0402]
C55  100nF  [CAP_0201]
C56  10nF  [CAP_0201]
C57  10nF  [CAP_0201]
C58  100nF  [CAP_0201]
C59  10pF  [CAP_0201]
C60  10pF  [CAP_0201]
C61  10pF  [CAP_0201]
C62  10pF  [CAP_0201]
C63  100nF  [CAP_0201]
C64  470nF  [CAP_0402]
FB1  15uH  [FB_0805]
FL1  2450FM07D0034T  [2450FM07D0034T]
IC1  SX1280IMLTRT  [QFN50P400X400X100-25N-D]
J5  U.FL-R-SMT(01)  [HRS_U.FL-R-SMT(01)]
LED3  GREEN  [LED_0402_GREEN]  (value not drawn)
PCNANT1  PCB Antenna 2.4Ghz Nano  [PCB Antena Micro 2.4Ghz]
R24  1k  [RES_0201]
R25  12k  [RES_0201]
R26  12k  [RES_0201]
R27  12k  [RES_0201]
R28  12k  [RES_0201]
R29  12k  [RES_0201]
R37  0  [RES_0402]
S2  EVPAKE31A  [EVPAKE31A]
U6  ESP8285  [QFN50P500X500X90-33N]
X1  26Mhz  [XTAL_2016]
X2  52Mhz  [XTAL_2016]

### Blocks framed on the sheet
ELRS MCU: C52-C55 C59 C61 LED3 PCNANT1 R24-R29 R37 S2 U6 X1
RF: C56-C58 C60 C62-C64 FB1 FL1 IC1 J5 X2

### Ports
ELRS (harness ELRS, see Overview[3B], MCU[1C])

### Harnesses
ELRS: RX_ELRS, TX_ERLS

### Nets
+3V3ELRS: C52.2 C53.2 C54.2 R26.2 R27.1 R29.1 U6.1(VDDA) U6.3(VDD3P3) U6.4(VDD3P3) U6.11(VDDPST) U6.17(VDDPST) U6.29(VDDD) U6.30(VDDA)
+3V3ELRS_FILT: C58.2 IC1.15(VBAT)
+3V3ELRS_FILT2: C63.2 IC1.11(VBAT_IO)
GND: C52.1 C53.1 C54.1 C55.1 C56.2 C57.2 C58.1 C59.1 C60.1 C61.1 C62.1 C63.1 C64.2 FL1.2(GND_1) FL1.4(GND_2) IC1.5(GND_1) IC1.13(GND_2) IC1.20(GND_3) IC1.21(GND_4) IC1.23(GND_5) IC1.24(GND_6) IC1.25(EP) J5.1(GND) J5.2(GND) R24.2 R25.1 R28.1 S2.1 S2.2 S2.4 S2.5 U6.33(GND) X1.2 X1.4 X2.2 X2.4
ELRS_BUSY: IC1.7(BUSY) U6.24(GPIO5)
ELRS_DIO1: IC1.8(DIO1) U6.16(GPIO4)
ELRS_RST: IC1.3(NRESET) U6.14(GPIO2)
ELRS_RX: U6.25(U0RXD) ; port ELRS.RX_ELRS
ELRS_SPI_CLK: IC1.18(SCK_RTSN) U6.9(MTMS)
ELRS_SPI_CS: IC1.19(NSS_CTS) R28.2 U6.13(MTDO)
ELRS_SPI_MISO: IC1.16(MISO_TX) U6.10(MTDI)
ELRS_SPI_MOSI: IC1.17(MOSI_RX) U6.12(MTCK)
ELRS_STAT_LED: LED3.A U6.8(XPD_DCDC)
ELRS_TX: U6.26(U0TXD) ; port ELRS.TX_ERLS
ELRS_XTAL_IN: C59.2 U6.28(XTAL_IN) X1.1
ELRS_XTAL_OUT: C61.2 U6.27(XTAL_OUT) X1.3
ESP_BOOT: R27.2 S2.3 U6.15(GPIO0)
ESP_CHIP_EN: R29.2 U6.7(CHIP_EN)
ESP_RST: C55.2 R26.1 U6.32(~{EXT_RST})
IRS: C56.1 C64.1 FB1.2 IC1.2(VDD_IN) IC1.12(DCC_FB)
SX1280_SW: FB1.1 IC1.14(DCC_SW)
SX1280_XTA: C60.2 IC1.4(XTA) X2.3
SX1280_XTB: C62.2 IC1.6(XTB) X2.1
NetC57_1: C57.1 IC1.1(VR_PA)
NetFL1_1: FL1.1(IN) IC1.22(RFIO)
NetFL1_3: FL1.3(OUT) J5.3(SIG)
NetLED3_K: LED3.K R24.1
NetPCNANT1_1: PCNANT1.1(ANT_IN) R37.2
NetR25_2: R25.2 U6.31(RES12K)
NetR37_1: R37.1 U6.2(LNA)

Not connected (* = marked no-connect by the designer): IC1 9(DIO2)* 10(DIO3)*; U6 5(VDD_RTC)* 6(TOUT)* 18(SD_DATA_2)* 19(SD_DATA_3)* 20(SD_CMD)* 21(SD_CLK)* 22(SD_DATA_0)* 23(SD_DATA_1)*

### Notes on the sheet
- We will test the USBC footrpinrt
- Notes
- Also test the SDCard footpint -> Maybe on the 5v reg board
- LNA, Ceramic antenna
- Diversity with ufl and ceramic antenna
- TODO: Literally try to compile the code with such pinout before finishing sch
- TODO: Add pads and test points
- Digikey, murata: LFB182G45SG9A293
- Add small pads for external connections
- Add logic for turning off ELRs. Pinio & zero ohm resistor
- Murata alternative: RF Filter LFB182G45BG5D920
- Best filter for SX1280:  2450FM07D0034
- TDK alternative: DEA162450BT-1262B1, C307895
- See antenna datasheet 15 mm spacing according to SPRacing
- (near J5) BWU.FL-IPEX1, C5137195
- TODO: Fix footprint
- Reset
- OK
- (near U6) OK
- SURE THIS IS NEEDED??
- LongRange Application Example
- Add references
- (near C58) 100nF 16V 0402 X7R 10%
- There is 0201 component that meets that
- TODO
- (near X1) Change to: TAXM26M4ZDBDDT2T
- Change to: XC21M4-52.000-F10NNHPL
- (near R29) Pullups on Chip Enable, ESP reset and Boot
- (near R28) Pull down on MTDO
- (near C63) 100nF 16V 0402 X7R 10%
- (near FB1) 15uH 120mA: MLZ2012M150WT000

### Library data of the parts
C52 C54 C64 = CAP_0402: Capacitor SMD 0402; Manufacturer: *; Manufacturer Part Number: *; Distributor Link: *; LCSC: *; Rating: *; Dielectric: *
C53 C55-C63 = CAP_0201: Capacitor SMD 0201; Manufacturer: *; Manufacturer Part Number: *; Distributor Link: *; LCSC: *; Rating: *; Dielectric: *
FB1 = FB_0805: Ferrite Bead SMD 0805; Manufacturer: *; Manufacturer Part Number: *; Distributor Link: *; LCSC: *
FL1 = 2450FM07D0034T: Filter; Manufacturer_Name: JOHANSON TECHNOLOGY; Datasheet Link: https://www.mouser.co.uk/datasheet/2/611/2450FM07D0034-1375634.pdf; Height: 0.4mm; Manufacturer_Part_Number: 2450FM07D0034T; Mouser Part Number: 609-2450FM07D0034T; Mouser Price/Stock: https://www.mouser.co.uk/ProductDetail/Johanson-Technology/2450FM07D0034T?qs=%252BEew9%252B0nqrBEY7VUloPs4Q%3D%3D; Arrow Part Number: 2450FM07D0034T; Arrow Price/Stock: https://www.arrow.com/en/products/2450fm07d0034t/johanson-dielectrics?region=nac
IC1 = SX1280IMLTRT: Integrated Circuit; Manufacturer_Name: SEMTECH; Datasheet Link: https://datasheet.datasheetarchive.com/originals/distributors/DKDS-37/728740.pdf; Height: 1mm; Manufacturer_Part_Number: SX1280IMLTRT; Mouser Part Number: 947-SX1280IMLTRT; Mouser Price/Stock: https://www.mouser.co.uk/ProductDetail/Semtech/SX1280IMLTRT?qs=5aG0NVq1C4xuoq8G6ZzdxQ%3D%3D; Arrow Part Number: SX1280IMLTRT; Arrow Price/Stock: https://www.arrow.com/en/products/sx1280imltrt/semtech?region=nac
J5 = U.FL-R-SMT(01): U.FL (UMCC) Connector Receptacle, Male Pin 50Ohm Surface Mount Solder. RF Connectors / Coaxial Connectors; MF: Hirose; Check_prices: https://www.snapeda.com/parts/U.FL-R-SMT(01)/Hirose+Electric+Co+Ltd/view-part/?ref=eda; LCSC Part #: *; Availability: In Stock; MP: U.FL-R-SMT(01); Price: None; Package: None; SnapEDA_Link: https://www.snapeda.com/parts/U.FL-R-SMT(01)/Hirose+Electric+Co+Ltd/view-part/?ref=snap; Purchase-URL: https://pricing.snapeda.com/search/part/U.FL-R-SMT(01)/?ref=eda
LED3 = LED_0402_GREEN: LED 0402 GREEN SMD
R24-R29 = RES_0201: Resistor SMD 0201; Manufacturer: *; Manufacturer Part Number: *; Distributor Link: *; LCSC: *
R37 = RES_0402: Resistor SMD 0402; Manufacturer: *; Manufacturer Part Number: *; Distributor Link: *; LCSC: *
U6 = ESP8285: IC RF TxRx + MCU WiFi 802.11b/g/n 2.4GHz 32-VFQFN Exposed Pad; MF: Espressif Systems; SnapEDA_Link: https://www.snapeda.com/parts/ESP8285/Espressif%20Systems/view-part/2603302/?ref=snap; Price: None; MP: ESP8285; Package: VFQFN-32 Espressif Systems; Value: *; Availability: Unavailable
X1 X2 = XTAL_2016: Crystal SMD 4-Pin 2.0x1.6mm; Distributor Link: *

## Nets that join several sheets
+3V3_MCU: MCU (25 pins), Peripherals (6 pins), PowerSupply (3.1 C36.2 R19.1)
+3V3ELRS: PowerSupply (5 pins), ELRS (13 pins)
+3V3ELRS_FILT: PowerSupply (C30.3), ELRS (C58.2 IC1.15)
+3V3ELRS_FILT2: PowerSupply (C33.3), ELRS (C63.2 IC1.11)
+3V3SENS: Peripherals (7 pins), PowerSupply (1.1 C32.2 L4.1 R17.1)
+3V3SENS_FILT: Peripherals (6 pins), PowerSupply (C40.2 L4.2)
+5V: PowerSupply (11 pins), ExternalConnections (P18.1)
+5V2REG: PowerSupply (6 pins), ExternalConnections (C65.1 P2.1 P17.1 P22.1)
+5VUSB: MCU (R30.1), PowerSupply (D2.A), ExternalConnections (J3.A4_B9 J3.A9_B4)
+9V: PowerSupply (5 pins), ExternalConnections (C34.1 C51.1 J2.1)
+VBAT: MCU (R11.2), PowerSupply (9 pins), ExternalConnections (J1.7)
GND: MCU (26 pins), Peripherals (21 pins), PowerSupply (45 pins), ExternalConnections (21 pins), ELRS (36 pins)
9V_EN: MCU (L1.B3), PowerSupply (Q1.2 R16.2)
ADC2_CH4_CURR: MCU (L1.H4), ExternalConnections (J1.2)
BUZZ: MCU (L1.G6), ExternalConnections (Q2.2 R21.2)
CLK_FLASH: MCU (L1.A3), Peripherals (U5.6)
CS_FLASH: MCU (L1.C3), Peripherals (R20.1 U5.1)
ELRS_EN: MCU (L1.G3), PowerSupply (Q3.2 R34.2)
ELRS_RX: MCU (L1.J2), ELRS (U6.25)
ELRS_TX: MCU (L1.K2), ELRS (U6.26)
FSYNC_IMU1: MCU (L1.K5), Peripherals (ICM1.9)
I2C2_SCL: MCU (L1.J7 R1.1), Peripherals (U3.2)
I2C2_SDA: MCU (L1.K7 R3.1), Peripherals (U3.4)
I2C4_SCL_EXT: MCU (L1.K10 R2.1), ExternalConnections (P12.1)
I2C4_SDA_EXT: MCU (L1.J10 R4.1), ExternalConnections (P9.1)
LED_STRIP: MCU (L1.E9), ExternalConnections (P19.1 P20.1)
M1: MCU (L1.A4), ExternalConnections (J1.6)
M2: MCU (L1.B4), ExternalConnections (J1.5)
M3: MCU (L1.A5), ExternalConnections (J1.4)
M4: MCU (L1.B5), ExternalConnections (J1.3)
M5: MCU (L1.A6), ExternalConnections (P3.1)
M6: MCU (L1.C5), ExternalConnections (P4.1)
M7: MCU (L1.A7), ExternalConnections (P5.1)
M8: MCU (L1.A8), ExternalConnections (P6.1)
MISO_FLASH: MCU (L1.D3), Peripherals (U5.2)
MOSI_FLASH: MCU (L1.E3), Peripherals (U5.5)
RX3: MCU (L1.J9), ExternalConnections (P14.1)
RX4: MCU (L1.H2), ExternalConnections (J2.6)
RX6: MCU (L1.E10), ExternalConnections (P13.1)
RX7_TEL: MCU (L1.D9), ExternalConnections (J1.1)
RX8: MCU (L1.D4), ExternalConnections (J2.4)
SPI1_CLK_IMU1: MCU (L1.H3), Peripherals (ICM1.13)
SPI1_CS_IMU1: MCU (L1.K4), Peripherals (ICM1.12)
SPI1_EXTI0_IMU1: MCU (L1.J4), Peripherals (ICM1.4)
SPI1_MISO_IMU1: MCU (L1.J3), Peripherals (ICM1.1)
SPI1_MOSI_IMU1: MCU (L1.K3), Peripherals (ICM1.14)
SPI2_CLK_IMU2: MCU (L1.J8), Peripherals (BMI.13)
SPI2_CS_IMU2: MCU (L1.K8), Peripherals (BMI.12)
SPI2_EXTI13_IMU2: MCU (L1.K6), Peripherals (BMI.4)
SPI2_MISO_IMU2: MCU (L1.H10), Peripherals (BMI.1)
SPI2_MOSI_IMU2: MCU (L1.G10), Peripherals (BMI.14)
TX3: MCU (L1.K9), ExternalConnections (P11.1)
TX6: MCU (L1.F10), ExternalConnections (P10.1)
TX8: MCU (L1.C4), ExternalConnections (J2.3)
USB_D_N: MCU (L1.C10), ExternalConnections (J3.A7 J3.B7)
USB_D_P: MCU (L1.B10), ExternalConnections (J3.A6 J3.B6)
VBAT_SENS: MCU (R5.2), ExternalConnections (P7.1)